# Altium project motordriver-v6.0.PrjPcb (part 1 of 2)
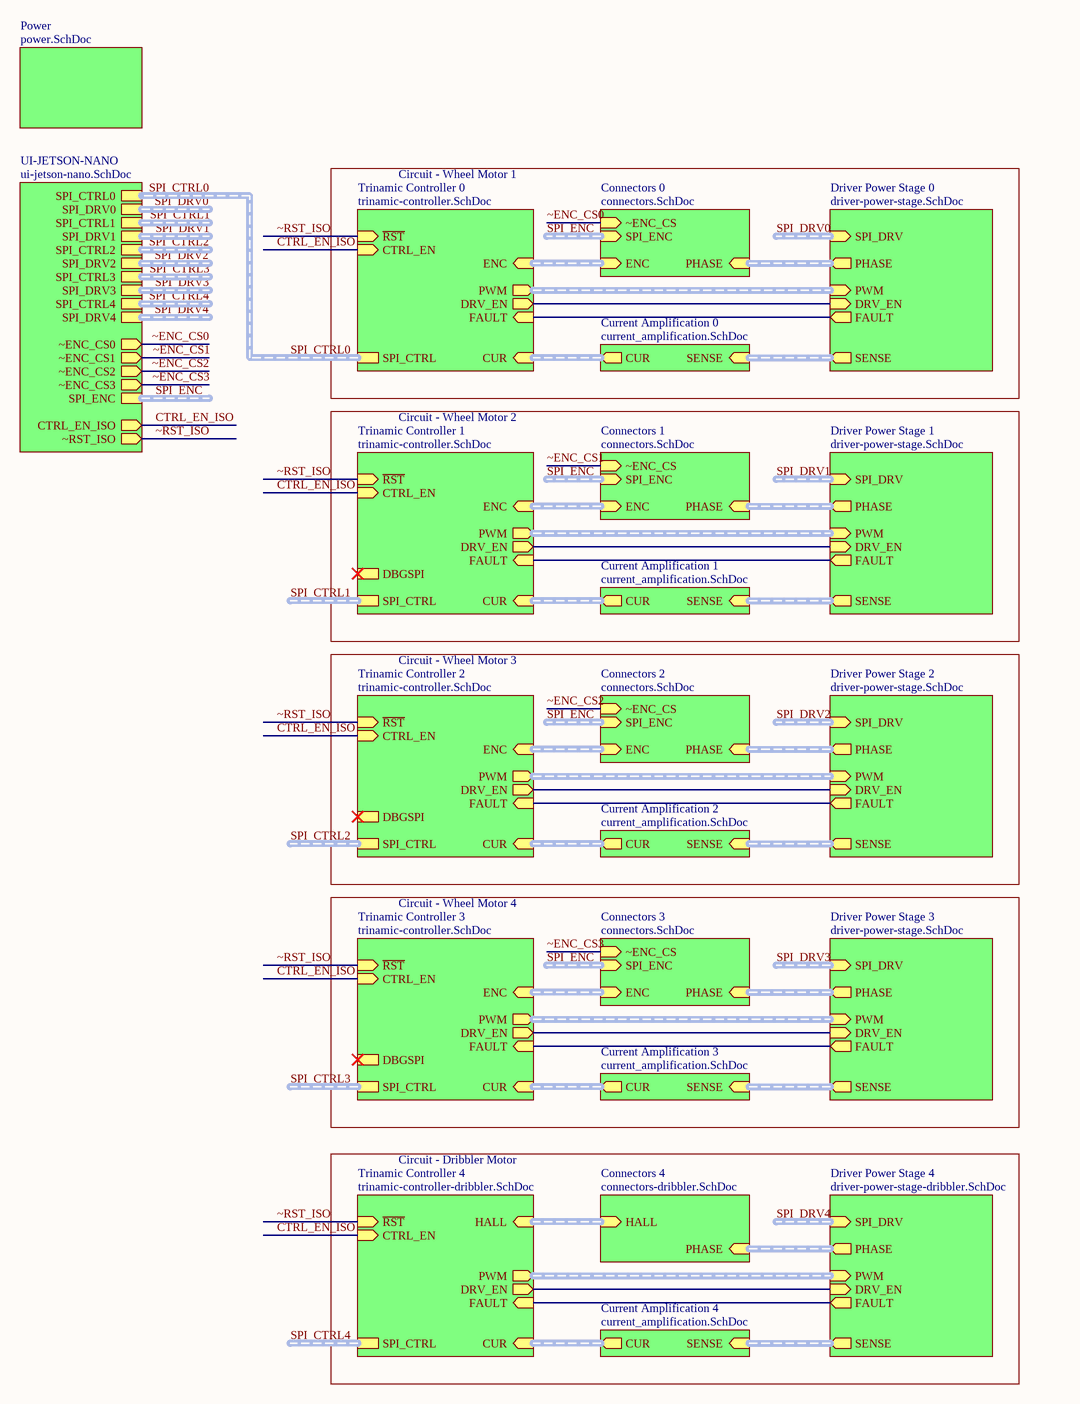
[diagram p0: root.SchDoc]
7 sheets, 321 parts. Net scope: hierarchical (ports join the sheet entries above them; power ports are global).
Board file: motordriver-v5.3.PcbDoc
Sheets:
  root.SchDoc
    Driver Power Stage 0 = driver-power-stage.SchDoc
    Connectors 0 = connectors.SchDoc
    Power = power.SchDoc
    UI-JETSON-NANO = ui-jetson-nano.SchDoc
      U_isolation_0 = isolation.SchDoc
      U_isolation_1 = isolation.SchDoc
      U_isolation_2 = isolation.SchDoc
      U_isolation_3 = isolation.SchDoc
    Trinamic Controller 4 = trinamic-controller-dribbler.SchDoc
    Driver Power Stage 1 = driver-power-stage.SchDoc
    Connectors 1 = connectors.SchDoc
    Driver Power Stage 2 = driver-power-stage.SchDoc
    Connectors 2 = connectors.SchDoc
    Driver Power Stage 3 = driver-power-stage.SchDoc
    Connectors 3 = connectors.SchDoc

## Sheet root.SchDoc
size 420 x 297 mm; SheetNumber: 2; SheetTotal: 14

### Sub-sheets
Connectors 0 = connectors.SchDoc: PHASE (in, harness PHASE), ENC (in, harness ENC), SPI_ENC (in, harness SPI_ENC), ~ENC_CS (in)
Connectors 1 = connectors.SchDoc: PHASE (in, harness PHASE), ENC (in, harness ENC), SPI_ENC (in, harness SPI_ENC), ~ENC_CS (in)
Connectors 2 = connectors.SchDoc: PHASE (in, harness PHASE), ENC (in, harness ENC), SPI_ENC (in, harness SPI_ENC), ~ENC_CS (in)
Connectors 3 = connectors.SchDoc: PHASE (in, harness PHASE), ENC (in, harness ENC), SPI_ENC (in, harness SPI_ENC), ~ENC_CS (in)
Connectors 4 = connectors-dribbler.SchDoc (file not in this document): PHASE (in, harness PHASE), HALL (in, harness ENC)
Current Amplification 0 = current_amplification.SchDoc (file not in this document): SENSE (in, harness SENSE), CUR (out, harness CUR)
Current Amplification 1 = current_amplification.SchDoc (file not in this document): SENSE (in, harness SENSE), CUR (out, harness CUR)
Current Amplification 2 = current_amplification.SchDoc (file not in this document): SENSE (in, harness SENSE), CUR (out, harness CUR)
Current Amplification 3 = current_amplification.SchDoc (file not in this document): SENSE (in, harness SENSE), CUR (out, harness CUR)
Current Amplification 4 = current_amplification.SchDoc (file not in this document): SENSE (in, harness SENSE), CUR (out, harness CUR)
Driver Power Stage 0 = driver-power-stage.SchDoc: DRV_EN (in), PWM (in, harness PWM), FAULT (out), SENSE (out, harness SENSE), PHASE (out, harness PHASE), SPI_DRV (in, harness DRV)
Driver Power Stage 1 = driver-power-stage.SchDoc: DRV_EN (in), PWM (in, harness PWM), FAULT (out), SENSE (out, harness SENSE), PHASE (out, harness PHASE), SPI_DRV (in, harness DRV)
Driver Power Stage 2 = driver-power-stage.SchDoc: DRV_EN (in), PWM (in, harness PWM), FAULT (out), SENSE (out, harness SENSE), PHASE (out, harness PHASE), SPI_DRV (in, harness DRV)
Driver Power Stage 3 = driver-power-stage.SchDoc: DRV_EN (in), PWM (in, harness PWM), FAULT (out), SENSE (out, harness SENSE), PHASE (out, harness PHASE), SPI_DRV (in, harness DRV)
Driver Power Stage 4 = driver-power-stage-dribbler.SchDoc (file not in this document): DRV_EN (in), PWM (in, harness PWM), FAULT (out), SENSE (out, harness SENSE), PHASE (out, harness PHASE), SPI_DRV (in, harness DRV)
Power = power.SchDoc: no entries
Trinamic Controller 0 = trinamic-controller.SchDoc (file not in this document): ~{RST} (in), CUR (in, harness CUR), DRV_EN (out), CTRL_EN (in), PWM (out, harness PWM), FAULT (in), ENC (in, harness ENC), SPI_CTRL (harness CTRL)
Trinamic Controller 1 = trinamic-controller.SchDoc (file not in this document): ~{RST} (in), CUR (in, harness CUR), DRV_EN (out), CTRL_EN (in), PWM (out, harness PWM), FAULT (in), ENC (in, harness ENC), SPI_CTRL (harness CTRL), DBGSPI (harness DRV)
Trinamic Controller 2 = trinamic-controller.SchDoc (file not in this document): ~{RST} (in), CUR (in, harness CUR), DRV_EN (out), CTRL_EN (in), PWM (out, harness PWM), FAULT (in), ENC (in, harness ENC), SPI_CTRL (harness CTRL), DBGSPI (harness DRV)
Trinamic Controller 3 = trinamic-controller.SchDoc (file not in this document): ~{RST} (in), CUR (in, harness CUR), DRV_EN (out), CTRL_EN (in), PWM (out, harness PWM), FAULT (in), ENC (in, harness ENC), SPI_CTRL (harness CTRL), DBGSPI (harness DRV)
Trinamic Controller 4 = trinamic-controller-dribbler.SchDoc: ~{RST} (in), CUR (in, harness CUR), DRV_EN (out), CTRL_EN (in), PWM (out, harness PWM), FAULT (in), SPI_CTRL (harness CTRL), HALL (in, harness ENC)
UI-JETSON-NANO = ui-jetson-nano.SchDoc: SPI_CTRL0 (harness CTRL), SPI_DRV0 (harness DRV), SPI_ENC (harness SPI_ENC), ~ENC_CS0 (out), ~ENC_CS1 (out), ~ENC_CS2 (out), ~ENC_CS3 (out), SPI_CTRL4 (harness CTRL), SPI_CTRL1 (harness CTRL), SPI_DRV1 (harness DRV), SPI_CTRL2 (harness CTRL), SPI_DRV2 (harness DRV), SPI_CTRL3 (harness CTRL), SPI_DRV3 (harness DRV), SPI_DRV4 (harness DRV), ~RST_ISO (out), CTRL_EN_ISO (out)

### Nets
CTRL_EN_ISO: sheet Trinamic Controller 0/CTRL_EN, sheet UI-JETSON-NANO/CTRL_EN_ISO, sheet Trinamic Controller 4/CTRL_EN, sheet Trinamic Controller 1/CTRL_EN, sheet Trinamic Controller 2/CTRL_EN, sheet Trinamic Controller 3/CTRL_EN
DRV_EN: sheet Driver Power Stage 4/DRV_EN, sheet Trinamic Controller 4/DRV_EN
DRV_EN_Driver Power Stage 0: sheet Driver Power Stage 0/DRV_EN, sheet Trinamic Controller 0/DRV_EN
DRV_EN_Driver Power Stage 1: sheet Driver Power Stage 1/DRV_EN, sheet Trinamic Controller 1/DRV_EN
DRV_EN_Driver Power Stage 2: sheet Driver Power Stage 2/DRV_EN, sheet Trinamic Controller 2/DRV_EN
DRV_EN_Driver Power Stage 3: sheet Driver Power Stage 3/DRV_EN, sheet Trinamic Controller 3/DRV_EN
FAULT: sheet Driver Power Stage 4/FAULT, sheet Trinamic Controller 4/FAULT
FAULT_Driver Power Stage 0: sheet Driver Power Stage 0/FAULT, sheet Trinamic Controller 0/FAULT
FAULT_Driver Power Stage 1: sheet Driver Power Stage 1/FAULT, sheet Trinamic Controller 1/FAULT
FAULT_Driver Power Stage 2: sheet Driver Power Stage 2/FAULT, sheet Trinamic Controller 2/FAULT
FAULT_Driver Power Stage 3: sheet Driver Power Stage 3/FAULT, sheet Trinamic Controller 3/FAULT
~ENC_CS0: sheet Connectors 0/~ENC_CS, sheet UI-JETSON-NANO/~ENC_CS0
~ENC_CS1: sheet UI-JETSON-NANO/~ENC_CS1, sheet Connectors 1/~ENC_CS
~ENC_CS2: sheet UI-JETSON-NANO/~ENC_CS2, sheet Connectors 2/~ENC_CS
~ENC_CS3: sheet UI-JETSON-NANO/~ENC_CS3, sheet Connectors 3/~ENC_CS
~RST_ISO: sheet Trinamic Controller 0/~{RST}, sheet UI-JETSON-NANO/~RST_ISO, sheet Trinamic Controller 4/~{RST}, sheet Trinamic Controller 1/~{RST}, sheet Trinamic Controller 2/~{RST}, sheet Trinamic Controller 3/~{RST}

### Buses and harness runs
harness sheet Connectors 0/ENC = sheet Trinamic Controller 0/ENC
harness sheet Connectors 0/PHASE = sheet Driver Power Stage 0/PHASE
harness sheet Connectors 1/ENC = sheet Trinamic Controller 1/ENC
harness sheet Connectors 1/PHASE = sheet Driver Power Stage 1/PHASE
harness sheet Connectors 2/ENC = sheet Trinamic Controller 2/ENC
harness sheet Connectors 2/PHASE = sheet Driver Power Stage 2/PHASE
harness sheet Connectors 3/ENC = sheet Trinamic Controller 3/ENC
harness sheet Connectors 3/PHASE = sheet Driver Power Stage 3/PHASE
harness sheet Connectors 4/HALL = sheet Trinamic Controller 4/HALL
harness sheet Connectors 4/PHASE = sheet Driver Power Stage 4/PHASE
harness sheet Current Amplification 0/CUR = sheet Trinamic Controller 0/CUR
harness sheet Current Amplification 0/SENSE = sheet Driver Power Stage 0/SENSE
harness sheet Current Amplification 1/CUR = sheet Trinamic Controller 1/CUR
harness sheet Current Amplification 1/SENSE = sheet Driver Power Stage 1/SENSE
harness sheet Current Amplification 2/CUR = sheet Trinamic Controller 2/CUR
harness sheet Current Amplification 2/SENSE = sheet Driver Power Stage 2/SENSE
harness sheet Current Amplification 3/CUR = sheet Trinamic Controller 3/CUR
harness sheet Current Amplification 3/SENSE = sheet Driver Power Stage 3/SENSE
harness sheet Current Amplification 4/CUR = sheet Trinamic Controller 4/CUR
harness sheet Current Amplification 4/SENSE = sheet Driver Power Stage 4/SENSE
harness sheet Driver Power Stage 0/PWM = sheet Trinamic Controller 0/PWM
harness sheet Driver Power Stage 1/PWM = sheet Trinamic Controller 1/PWM
harness sheet Driver Power Stage 2/PWM = sheet Trinamic Controller 2/PWM
harness sheet Driver Power Stage 3/PWM = sheet Trinamic Controller 3/PWM
harness sheet Driver Power Stage 4/PWM = sheet Trinamic Controller 4/PWM
harness SPI_CTRL0 = sheet Trinamic Controller 0/SPI_CTRL = sheet UI-JETSON-NANO/SPI_CTRL0
harness SPI_CTRL1 = sheet Trinamic Controller 1/SPI_CTRL
harness SPI_CTRL1 = sheet UI-JETSON-NANO/SPI_CTRL1
harness SPI_CTRL2 = sheet Trinamic Controller 2/SPI_CTRL
harness SPI_CTRL2 = sheet UI-JETSON-NANO/SPI_CTRL2
harness SPI_CTRL3 = sheet Trinamic Controller 3/SPI_CTRL
harness SPI_CTRL3 = sheet UI-JETSON-NANO/SPI_CTRL3
harness SPI_CTRL4 = sheet Trinamic Controller 4/SPI_CTRL
harness SPI_CTRL4 = sheet UI-JETSON-NANO/SPI_CTRL4
harness SPI_DRV0 = sheet Driver Power Stage 0/SPI_DRV
harness SPI_DRV0 = sheet UI-JETSON-NANO/SPI_DRV0
harness SPI_DRV1 = sheet Driver Power Stage 1/SPI_DRV
harness SPI_DRV1 = sheet UI-JETSON-NANO/SPI_DRV1
harness SPI_DRV2 = sheet Driver Power Stage 2/SPI_DRV
harness SPI_DRV2 = sheet UI-JETSON-NANO/SPI_DRV2
harness SPI_DRV3 = sheet Driver Power Stage 3/SPI_DRV
harness SPI_DRV3 = sheet UI-JETSON-NANO/SPI_DRV3
harness SPI_DRV4 = sheet Driver Power Stage 4/SPI_DRV
harness SPI_DRV4 = sheet UI-JETSON-NANO/SPI_DRV4
harness SPI_ENC = sheet Connectors 0/SPI_ENC
harness SPI_ENC = sheet Connectors 1/SPI_ENC
harness SPI_ENC = sheet Connectors 2/SPI_ENC
harness SPI_ENC = sheet Connectors 3/SPI_ENC
harness SPI_ENC = sheet UI-JETSON-NANO/SPI_ENC

### Notes on the sheet
- Circuit - Wheel Motor 1
- Circuit - Wheel Motor 2
- Circuit - Wheel Motor 3
- Circuit - Wheel Motor 4
- Circuit - Dribbler Motor
- TITLE
- SCALE:
- A3
- SIZE
- FILE NAME
- SHEET
- OF
- REV

## Sheet driver-power-stage.SchDoc
size A4; SheetNumber: 10; SheetTotal: 14
Used 4 times, as channels Driver Power Stage 0, Driver Power Stage 1, Driver Power Stage 2, Driver Power Stage 3. Parts and nets are listed once, with the designators drawn on the sheet.
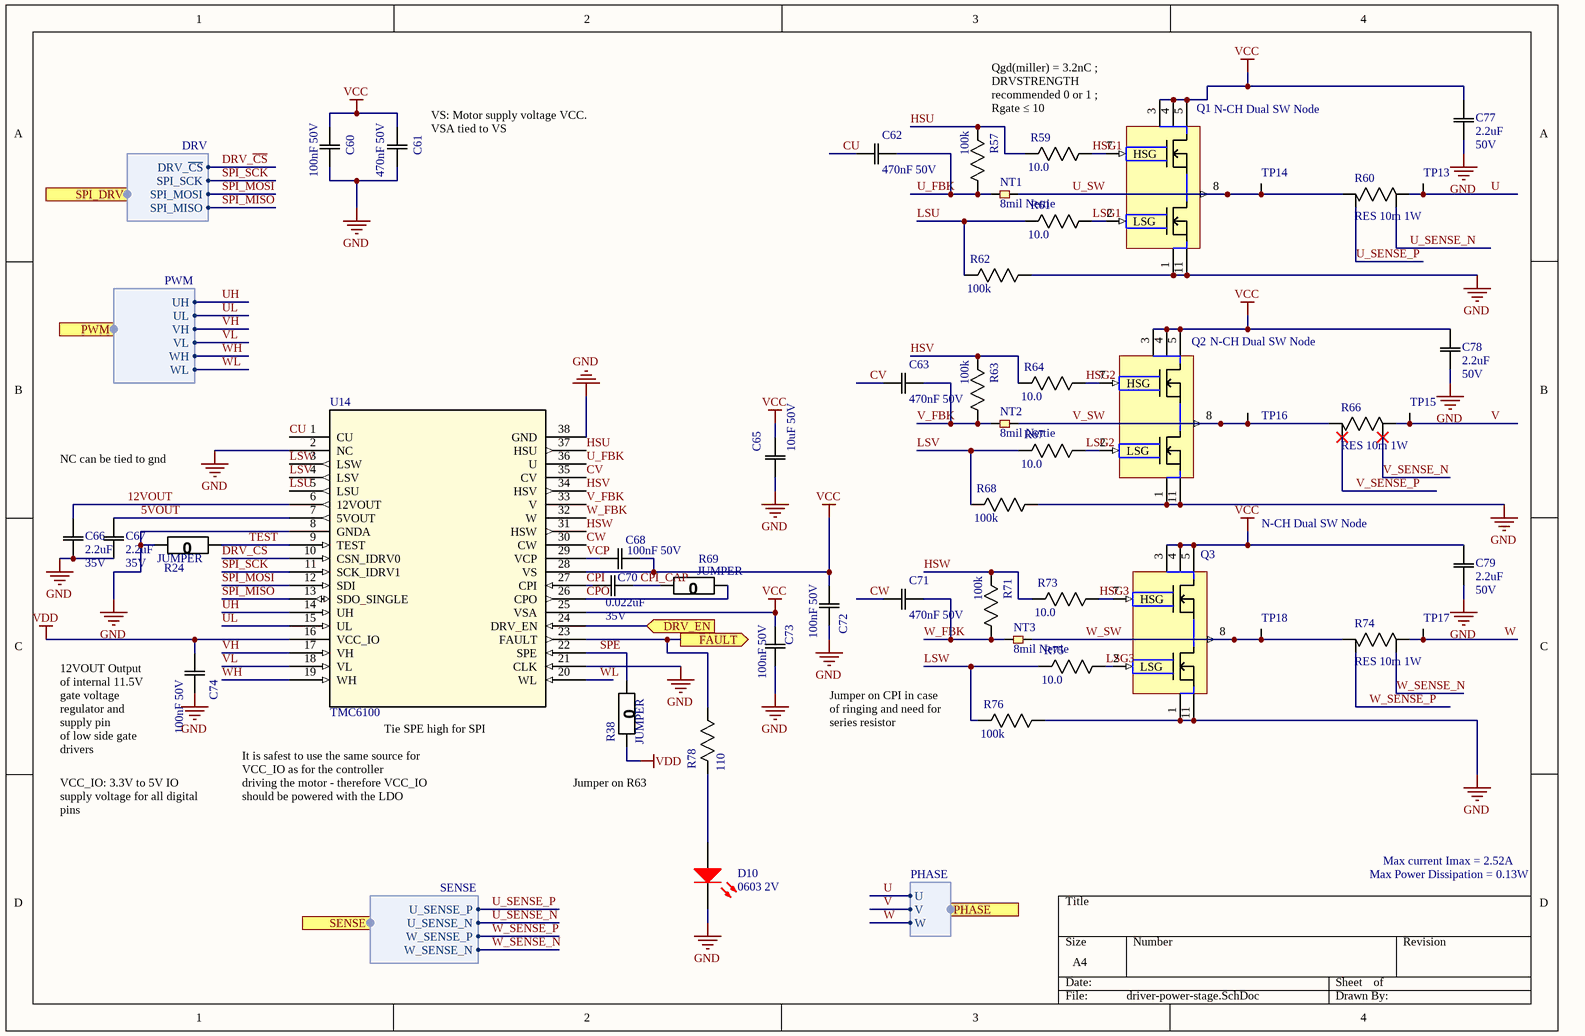
[diagram p1: driver-power-stage.SchDoc]

### Parts
C60  100nF 50V  [0603]
C61  470nF 50V  [0603]
C62  470nF 50V  [0603]
C63  470nF 50V  [0603]
C65  10uF 50V  [0805]
C66  value 2.2uF  Rating: 35V  [0603]  (hidden comment: 2.2uF 35V)
C67  value 2.2uF  Rating: 35V  [0603]  (hidden comment: 2.2uF 35V)
C68  100nF 50V  [0603]
C70  value 0.022uF  Rating: 35V  [0603]  (hidden comment: 0.022uF 35V)
C71  470nF 50V  [0603]
C72  100nF 50V  [0603]
C73  100nF 50V  [0603]
C74  100nF 50V  [0603]
C77  Rating: 50V  [0603]  (hidden comment: 2.2uF)
C78  Rating: 50V  [0603]  (hidden comment: 2.2uF)
C79  Rating: 50V  [0603]  (hidden comment: 2.2uF)
D10  0603 2V  [0603 - LED2]
NT1  8mil Nettie  [NT_8mil]  (net tie, no BOM)
NT2  8mil Nettie  [NT_8mil]  (net tie, no BOM)
NT3  8mil Nettie  [NT_8mil]  (net tie, no BOM)
Q1  N-CH Dual SW Node  [12-PowerWQFN]
Q2  N-CH Dual SW Node  [12-PowerWQFN]
Q3  N-CH Dual SW Node  [12-PowerWQFN]
R24  JUMPER  [0603]
R38  JUMPER  [0603]
R57  100k  [0603]
R59  10.0  [0603]
R60  RES 10m 1W  [1206 - Current Sense]
R61  10.0  [0603]
R62  100k  [0603]
R63  100k  [0603]
R64  10.0  [0603]
R66  RES 10m 1W  [1206 - Current Sense]
R67  10.0  [0603]
R68  100k  [0603]
R69  JUMPER  [0603]
R71  100k  [0603]
R73  10.0  [0603]
R74  RES 10m 1W  [1206 - Current Sense]
R75  10.0  [0603]
R76  100k  [0603]
R78  110  [0603]
TP13  U_SL  [TP]  (value not drawn)  (no BOM)
TP14  U_SH  [TP]  (value not drawn)  (no BOM)
TP15  V_SL  [TP]  (value not drawn)  (no BOM)
TP16  V_SH  [TP]  (value not drawn)  (no BOM)
TP17  W_SL  [TP]  (value not drawn)  (no BOM)
TP18  W_SH  [TP]  (value not drawn)  (no BOM)
U14  TMC6100  [QFN50P700X700X85_HS-38N]

### Ports
DRV_EN (in), FAULT (out), PHASE (harness PHASE), PWM (harness PWM), SENSE (harness SENSE), SPI_DRV (harness DRV)

### Harnesses
PWM: VL, WH, WL, VH, UL, UH
SENSE: U_SENSE_P, U_SENSE_N, W_SENSE_P, W_SENSE_N
PHASE: U, V, W
DRV: SPI_SCK, SPI_MISO, SPI_MOSI, DRV_~{CS}

### Nets
GND: C60.2(C2) C61.2(C2) C65.1(C1) C66.1(C1) C67.1(C1) C72.2(C2) C73.2(C2) C74.2(C2) C77.1(C1) C78.1(C1) C79.1(C1) D10.2(K) Q1.1(GND) Q1.11(GND) Q2.1(GND) Q2.11(GND) Q3.1(GND) Q3.11(GND) R24.2(R2) R62.1(R1) R68.1(R1) R76.1(R1) U14.2(NC) U14.8(GNDA) U14.21(CLK) U14.38(GND)
VCC: C60.1(C1) C61.1(C1) C65.2(C2) C68.2(C2) C72.1(C1) C73.1(C1) C77.2(C2) C78.2(C2) C79.2(C2) Q1.3(V+) Q1.4(V+) Q1.5(V+) Q2.3(V+) Q2.4(V+) Q2.5(V+) Q3.3(V+) Q3.4(V+) Q3.5(V+) U14.25(VSA) U14.28(VS)
VDD: C74.1(C1) R38.2(R2) U14.16(VCC_IO)
5VOUT: C67.2(C2) U14.7(5VOUT)
12VOUT: C66.2(C2) U14.6(12VOUT)
CPI: C70.1(C1) U14.27(CPI)
CPI_CAP: C70.2(C2) R69.2(R2)
CPO: R69.1(R1) U14.26(CPO)
CU: C62.1(C1) U14.1(CU)
CV: C63.1(C1) U14.35(CV)
CW: C71.1(C1) U14.30(CW)
DRV_~{CS}: U14.10(CSN_IDRV0) ; port SPI_DRV.DRV_~{CS}
DRV_EN: U14.24(DRV_EN) ; port DRV_EN
FAULT: R78.1(R1) U14.23(FAULT) ; port FAULT
HSG1: Q1.7(HSG) R59.1(R1)
HSG2: Q2.7(HSG) R64.1(R1)
HSG3: Q3.7(HSG) R73.1(R1)
HSU: R57.2(R2) R59.2(R2) U14.37(HSU)
HSV: R63.2(R2) R64.2(R2) U14.34(HSV)
HSW: R71.2(R2) R73.2(R2) U14.31(HSW)
LSG1: Q1.2(LSG) R61.1(R1)
LSG2: Q2.2(LSG) R67.1(R1)
LSG3: Q3.2(LSG) R75.1(R1)
LSU: R61.2(R2) R62.2(R2) U14.5(LSU)
LSV: R67.2(R2) R68.2(R2) U14.4(LSV)
LSW: R75.2(R2) R76.2(R2) U14.3(LSW)
SPE: R38.1(R1) U14.22(SPE)
SPI_MISO: U14.13(SDO_SINGLE) ; port SPI_DRV.SPI_MISO
SPI_MOSI: U14.12(SDI) ; port SPI_DRV.SPI_MOSI
SPI_SCK: U14.11(SCK_IDRV1) ; port SPI_DRV.SPI_SCK
TEST: R24.1(R1) U14.9(TEST)
U: R60.1 TP13.1 ; port PHASE.U
U_FBK: C62.2(C2) NT1.1 R57.1(R1) U14.36(U)
U_SENSE_N: R60.S1 ; port SENSE.U_SENSE_N
U_SENSE_P: R60.S2 ; port SENSE.U_SENSE_P
U_SW: NT1.2 Q1.8(SW) R60.2 TP14.1
UH: U14.14(UH) ; port PWM.UH
UL: U14.15(UL) ; port PWM.UL
V: R66.1 TP15.1 ; port PHASE.V
V_FBK: C63.2(C2) NT2.1 R63.1(R1) U14.33(V)
V_SENSE_N: R66.S1
V_SENSE_P: R66.S2
V_SW: NT2.2 Q2.8(SW) R66.2 TP16.1
VCP: C68.1(C1) U14.29(VCP)
VH: U14.17(VH) ; port PWM.VH
VL: U14.18(VL) ; port PWM.VL
W: R74.1 TP17.1 ; port PHASE.W
W_FBK: C71.2(C2) NT3.1 R71.1(R1) U14.32(W)
W_SENSE_N: R74.S1 ; port SENSE.W_SENSE_N
W_SENSE_P: R74.S2 ; port SENSE.W_SENSE_P
W_SW: NT3.2 Q3.8(SW) R74.2 TP18.1
WH: U14.19(WH) ; port PWM.WH
WL: U14.20(WL) ; port PWM.WL
NetD10_1: D10.1(A) R78.2(R2)

### Channels
Driver Power Stage 0: designators end in A; ports DRV_EN=DRV_EN_Driver Power Stage 0 FAULT=FAULT_Driver Power Stage 0
Driver Power Stage 1: designators end in B; ports DRV_EN=DRV_EN_Driver Power Stage 1 FAULT=FAULT_Driver Power Stage 1
Driver Power Stage 2: designators end in C; ports DRV_EN=DRV_EN_Driver Power Stage 2 FAULT=FAULT_Driver Power Stage 2
Driver Power Stage 3: designators end in D; ports DRV_EN=DRV_EN_Driver Power Stage 3 FAULT=FAULT_Driver Power Stage 3

### Notes on the sheet
- Text
- (near Q1) Qgd(miller) = 3.2nC ; DRVSTRENGTH recommended 0 or 1 ; Rgate ≤ 10
- (near C61) VS: Motor supply voltage VCC. VSA tied to VS
- NC can be tied to gnd
- (near C74) 12VOUT Output of internal 11.5V gate voltage regulator and supply pin
  of low side gate drivers
- Tie SPE high for SPI
- Jumper on CPI in case of ringing and need for series resistor
- VCC_IO: 3.3V to 5V IO supply voltage for all digital pins
- It is safest to use the same source for VCC_IO as for the controller
  driving the motor - therefore VCC_IO should be powered with the LDO
- Jumper on R63
- Max Power Dissipation = 0.13W
- Max current Imax = 2.52A

### Library data of the parts
C60 C68 C72-C74 = CAP 100nF 50V: Default Symbol for Capacitors; Manufacturer Part Number 1: CC0603KPX7R9BB104; Tolerance: 10%; Temperature Coefficient: X7R; VALUE: 100nF; Rating: 50V; Part Number: CAP 100nF 50V; Supplier 1: Digi-Key; Supplier Part Number 1: 311-3567-1-ND; Manufacturer Part Number 2: 0805J0500104KJT; Supplier 2: Digi-Key; Supplier Part Number 2: 1608-1458-1-ND
C61-C63 C71 = CAP 470nF 50V: Default Symbol for Capacitors; Manufacturer Part Number 1: C1608X7R1H474K080AC; Tolerance: 10%; Temperature Coefficient: X7R; VALUE: 470nF; Rating: 50V; Part Number: CAP 470nF 50V; Supplier 1: Digi-Key; Supplier Part Number 1: 445-5952-1-ND; Manufacturer Part Number 2: CL21B474KBFNNNG; Supplier 2: Digi-Key; Supplier Part Number 2: 1276-6482-1-ND
C65 = CAP 10uF 50V: Default Symbol for Capacitors; Manufacturer Part Number 1: GRM21BR61H106KE43L; Tolerance: 10%; Temperature Coefficient: X5R; VALUE: 10uF; Rating: 50V; Part Number: CAP 10uF 50V; Supplier 1: Digi-Key; Supplier Part Number 1: 490-18663-1-ND; Manufacturer Part Number 2: CL32B106KBJNNWE; Supplier 2: Digi-Key; Supplier Part Number 2: 1276-3388-1-ND
C66 C67 = CAP 2.2uF 35V: Default Symbol for Capacitors; Manufacturer Part Number 1: C1608X5R1V225K080AC; Tolerance: 10%; Temperature Coefficient: X5R; Part Number: CAP 2.2uF 35V; Supplier 1: Digi-Key; Supplier Part Number 1: 445-8025-1-ND; Manufacturer Part Number 2: CGA4J1X7R1V225K125AE; Supplier 2: Digi-Key; Supplier Part Number 2: 445-8787-1-ND
C70 = CAP 0.022uF 35V: Default Symbol for Capacitors; Manufacturer Part Number 1: GMK107BJ223KAHT; Tolerance: 10%; Temperature Coefficient: X7R; Part Number: CAP 0.022uF 35V; Supplier 1: Digi-Key; Supplier Part Number 1: 587-3359-1-ND; Manufacturer Part Number 2: GMK212SD223KG-T; Supplier 2: Digi-Key; Supplier Part Number 2: 587-1122-1-ND
C77-C79 = CAP 2.2uF 50V: CAP CER 2.2UF 50V X5R 0603/0805; Manufacturer Part Number 1: GRM188R61H225KE11D; Tolerance: 10%; Package: 0603/0805; Temperature Coefficient: X5R; Operating Temperature: -55°C ~ 125°C; Value: 2.2uF; Part Number: CAP 2.2uF 50V; Supplier 1: Mouser; Supplier Part Number 1: 81-GRM188R61H225KE1D
D10 = LED RED SMD 0603: 0603 red led alingap 631nm-639nm water clear 18-180mcd 130d; Manufacturer Part Number 1: LTST-C190KRKT; Current Rating: 20mA; Supplier 1: Digi-Key; Supplier Part Number 1: 160-1436-1-ND; Part Number: LED RED SMD 0603; Supplier URL 1: https://www.digikey.ca/en/products/detail/lite-on-inc/LTST-C190KRKT/386817?s=N4IgTCBcDaIIwDYAMBaOAWAzAtKByAIiALoC%2BQA; Pin Count: 2; Voltage Rating - DC: 2V
NT1-NT3 = NT_8: 8mil wide nettie; Value: 0; Part Number: NT_8
Q1-Q3 = MOSFET N-CH DUAL NTTFD4D0N04HLTWG: MOSFET N+N COMMON PHASE SW 40V 60A; Supplier 1: Digi-Key; Supplier Part Number 1: 488-NTTFD4D0N04HLTWGCT-ND; Part Number: MOSFET N-CH DUAL NTTFD4D0N04HLTWG; Supplier URL 1: https://www.digikey.ca/en/products/detail/onsemi/NTTFD4D0N04HLTWG/12181286?s=N4IgTCBcDaIHIBUEDEAiAWVAGOX0AkAZBAdQHEBhBEAXQF8g; Manufacturer Part Number 1: NTTFD4D0N04HLTWG
R24 R38 R69 = RES 0 JUMPER: RES SMD 0 OHM JUMPER GENERIC 0805; Manufacturer Part Number 1: RK73Z1JTTD; VALUE: 0; Package: 0805; Part Number: RES 0 JUMPER; Supplier 1: Digi-Key; Supplier Part Number 1: 2019-RK73Z1JTTDCT-ND; Supplier URL 1: https://www.digikey.ca/en/products/detail/koa-speer-electronics-inc/RK73Z1JTTD/9845478; Tolerance: N/A
R57 R62 R63 R68 R71 R76 = RES 100k 1/8W 5%: RES SMD 100K OHM 5% 1/8W 0805; Power (Watts): 0.125W; Package: 0805; VALUE: 100k; Tolerance: 5%; Part Number: RES 100k 1/8W 5%
R59 R61 R64 R67 R73 R75 = RES 10.0 1/8W - 1%: Default Resistor Symbol; Manufacturer Part Number 1: RNCP0603FTD10R0; VALUE: 10; Power (Watts): 0.125W; Tolerance: 1%; Package: 0805; Part Number: RES 10.0 1/8W - 1%; Supplier 1: Digi-Key; Supplier Part Number 1: RNCP0603FTD10R0CT-ND; Manufacturer Part Number 2: RNCP0603FTD10R0; Supplier 2: Digi-Key; Supplier Part Number 2: RNCP0603FTD10R0CT-ND; Tolerance 2: 1%; Supplier URL 1: https://www.digikey.ca/en/products/detail/stackpole-electronics-inc/RNCP0603FTD10R0/2240074?s=N4IgTCBcDaIEoDkDCAFADANjQZgGIBUARARjTjSXxAF0BfIA; Supplier URL 2: https://www.digikey.ca/en/products/detail/stackpole-electronics-inc/RNCP0603FTD10R0/2240074?s=N4IgTCBcDaIEoDkDCAFADANjQZgGIBUARARjTjSXxAF0BfIA
R60 R66 R74 = RES 10m 1W: RES SMD 0.01 OHM 1% 1W 1206; Manufacturer Part Number 1: CSRL1-0R01F8; Part Number: RES 10m 1W; Value: 10m; Tolerance: 1%; Supplier 1: Digi-Key; Supplier Part Number 1: 696-1845-1-ND; Supplier URL 1: https://www.digikey.ca/en/products/detail/riedon/CSRL1-0R01F8/9666060?s=N4IgTCBcDaIGwE44FoCMAOALAVjcgcgCIgC6AvkA
R78 = RES 110.0 1/8W - 1%: Default Resistor Symbol; Manufacturer Part Number 1: RMCF0603FT110R; Power (Watts): 0.125W; Tolerance: 1%; Package: 0805; Value: 110; Part Number: RES 110.0 1/8W - 1%; Supplier 1: Digi-Key; Supplier Part Number 1: RMCF0603FT110RCT-ND; Supplier URL 1: https://www.digikey.ca/en/products/detail/stackpole-electronics-inc/RMCF0603FT110R/1761268
TP13-TP18 = Test Point (Via): Part Number: Test Point (Via)
U14 = TMC6100: GATE DRIVER IC 8-60V QFN37; Manufacturer Part Number 1: TMC6100-LA; Supplier 1: Newark; Supplier Part Number 1: 54AH1603; Part Number: TMC6100; Supplier URL 1: https://canada.newark.com/trinamic/tmc6100-la/motor-driver-40-to-125deg-c-rohs/dp/54AH1603?ost=54ah1603

## Sheet connectors.SchDoc
size A4; SheetNumber: 13; SheetTotal: 14
Used 4 times, as channels Connectors 0, Connectors 1, Connectors 2, Connectors 3. Parts and nets are listed once, with the designators drawn on the sheet.
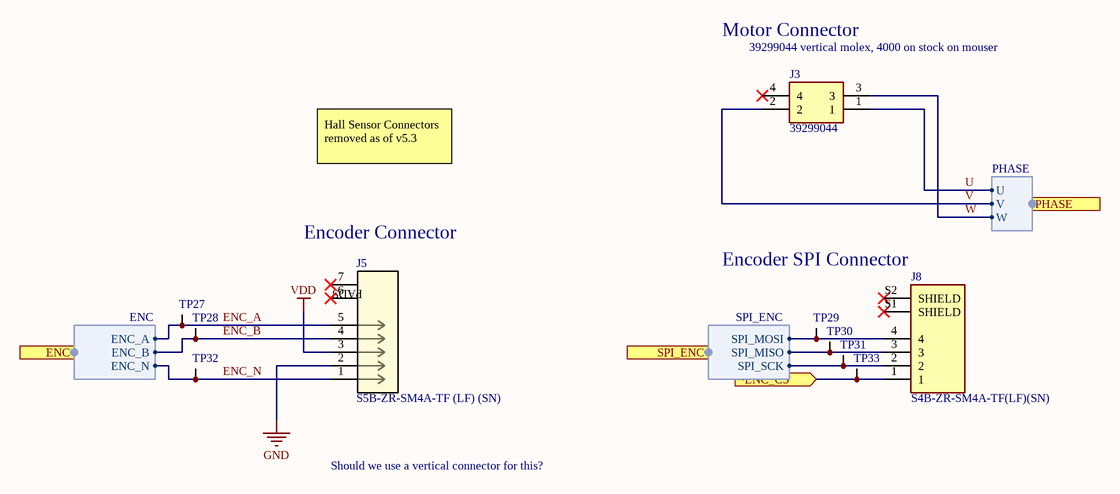
[diagram p2: connectors.SchDoc]

### Parts
J3  39299044  [39299044]
J5  S5B-ZR-SM4A-TF (LF) (SN)  [JST_S5B-ZR-SM4A-TF]
J8  S4B-ZR-SM4A-TF(LF)(SN)  [JST_S4B-ZR-SM4A-TF(LF)(SN)]  (no BOM)
TP27  ENC_A  [TP]  (value not drawn)  (no BOM)
TP28  ENC_B  [TP]  (value not drawn)  (no BOM)
TP29  MOSI  [TP]  (value not drawn)  (no BOM)
TP30  MISO  [TP]  (value not drawn)  (no BOM)
TP31  SCK  [TP]  (value not drawn)  (no BOM)
TP32  ENC_N  [TP]  (value not drawn)  (no BOM)
TP33  ENC_CS  [TP]  (value not drawn)  (no BOM)

### Ports
ENC (harness ENC), PHASE (harness PHASE), SPI_ENC (harness SPI_ENC), ~ENC_CS (in)

### Harnesses
ENC: ENC_A, ENC_N, ENC_B
PHASE: U, V, W
SPI_ENC: SPI_SCK, SPI_MISO, SPI_MOSI

### Nets
GND: J5.2
VDD: J5.3
ENC_A: J5.5 TP27.1 ; port ENC.ENC_A
ENC_B: J5.4 TP28.1 ; port ENC.ENC_B
ENC_N: J5.1 TP32.1 ; port ENC.ENC_N
U: J3.1 ; port PHASE.U
V: J3.2 ; port PHASE.V
W: J3.3 ; port PHASE.W
~ENC_CS: J8.1 TP33.1 ; port ~ENC_CS
NetJ8_2: J8.2 TP31.1 ; port SPI_ENC.SPI_SCK
NetJ8_3: J8.3 TP30.1 ; port SPI_ENC.SPI_MISO
NetJ8_4: J8.4 TP29.1 ; port SPI_ENC.SPI_MOSI

Not connected (* = marked no-connect by the designer): J3 4*; J5 6* 7*; J8 S1(SHIELD)* S2(SHIELD)*

### Channels
Connectors 0: designators end in A; ports ~ENC_CS=~ENC_CS0
Connectors 1: designators end in B; ports ~ENC_CS=~ENC_CS1
Connectors 2: designators end in C; ports ~ENC_CS=~ENC_CS2
Connectors 3: designators end in D; ports ~ENC_CS=~ENC_CS3

### Notes on the sheet
- Motor Connector
- (near J3) 39299044 vertical molex, 4000 on stock on mouser
- Hall Sensor Connectors removed as of v5.3
- (near J5) Encoder Connector
- (near J8) Encoder SPI Connector
- Should we use a vertical connector for this?
- (in symbol CN 5POS JST ZR RA) PADS

### Library data of the parts
J3 = CN HDR 4POS Molex 39299044 VERT: Molex 39299044 4POS Minifit / dual row, vertical; Supplier 1: Digi-Key; Supplier Part Number 1: WM7336-ND; Part Number: CN HDR 4POS Molex 39299044 VERT; Supplier URL 1: https://www.digikey.ca/en/products/detail/molex/0039299044/1624292?s=N4IgTCBcDaIOoFkDsBmFA2AtAOQCIgF0BfIA; Pin Count: 4; Manufacturer Part Number 1: 39299044
J5 = CN 5POS JST ZR RA: Connector Header Surface Mount, Right Angle 5 position 0.059" (1.50mm); Supplier 1: Digi-Key; Supplier Part Number 1: 455-1696-1-ND; Part Number: CN 5POS JST ZR RA; Supplier URL 1: https://www.digikey.ca/en/products/detail/jst-sales-america-inc/S5B-ZR-SM4A-TF-LF-SN/926603?s=N4IgTCBcDaICwFYEFoCMA2AnOtyByAIiALoC%2BQA; Pin Count: 5; Manufacturer Part Number 1: S5B-ZR-SM4A-TF
J8 = CN 4POS JST ZR RA: Connector Header Surface Mount, Right Angle 4 position 0.059 (1.50mm); MF: JST Sales; SnapEDA_Link: https://www.snapeda.com/parts/S4B-ZR-SM4A-TF(LF)(SN)/JST%20Sales%20America%20Inc./view-part/449060/?ref=snap; Availability: Unavailable; Value: *; Price: None; Arrow_Electronics-Purchase-URL: https://snapeda.com/shop?store=Arrow+Electronics&id=449060; MP: S4B-ZR-SM4A-TF(LF)(SN); Package: None; Part Number: CN 4POS JST ZR RA; Supplier 1: Digi-Key; Supplier Part Number 1: 455-1695-1-ND; Supplier URL 1: https://www.digikey.ca/en/products/detail/jst-sales-america-inc/S4B-ZR-SM4A-TF-LF-SN/926602?s=N4IgTCBcDaIMoBYBCBaAWgJRXAsgggigCoBiAFADIkCUZcActSALoC%2BQA; Pin Count: 4
TP27-TP33 = Test Point (Via): Part Number: Test Point (Via)

## Sheet power.SchDoc
size A4; SheetNumber: 2; SheetTotal: 14
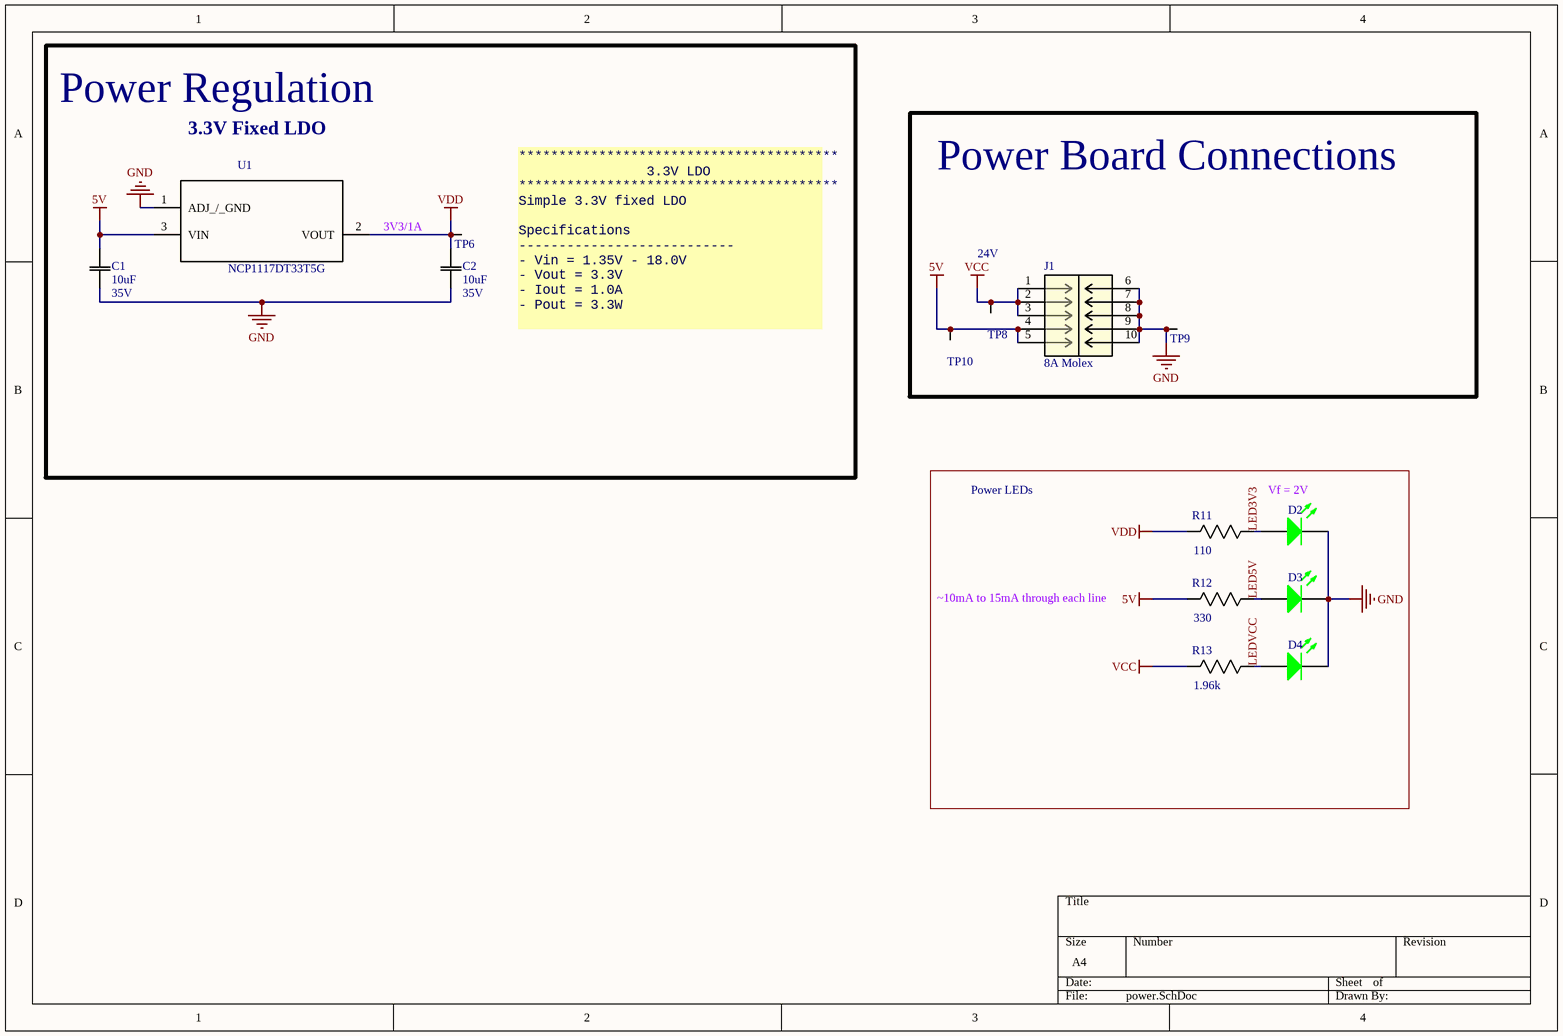
[diagram p3: power.SchDoc]

### Parts
C1  value 10uF  Rating: 35V  [0805]  (hidden comment: 10uF 35V)
C2  value 10uF  Rating: 35V  [0805]  (hidden comment: 10uF 35V)
D2  0603 2V  [0603 - LED]  (value not drawn)
D3  0603 2V  [0603 - LED]  (value not drawn)
D4  0603 2V  [0603 - LED]  (value not drawn)
J1  8A Molex  [MOLEX_0430451012]
R11  110  [0603]
R12  330  [0603]
R13  1.96k  [0603]
TP6  VDD  [TP]  (value not drawn)  (no BOM)
TP8  VCC  [TP]  (value not drawn)  (no BOM)
TP9  GND  [TP]  (value not drawn)  (no BOM)
TP10  5V  [TP]  (value not drawn)  (no BOM)
U1  NCP1117DT33T5G  [DPAK (TO-252)]

### Blocks framed on the sheet
Power Regulation: C1 C2 TP6 U1
Power Board Connections: J1 TP8-TP10

### Nets
5V: C1.2(C2) J1.4 J1.5 R12.2(R2) TP10.1 U1.3(VIN)
GND: C1.1(C1) C2.1(C1) D2.2(K) D3.2(K) D4.2(K) J1.6 J1.7 J1.8 J1.9 J1.10 TP9.1 U1.1(ADJ_/_GND)
VCC: J1.1 J1.2 J1.3 R13.2(R2) TP8.1
VDD: C2.2(C2) R11.2(R2) TP6.1 U1.2(VOUT)
LED3V3: D2.1(A) R11.1(R1)
LED5V: D3.1(A) R12.1(R1)
LEDVCC: D4.1(A) R13.1(R1)

### Notes on the sheet
- 3.3V Fixed LDO
- 3V3/1A
- 24V
- ****************************************
  3.3V LDO
  ****************************************
  Simple 3.3V fixed LDO
  Specifications
  ---------------------------
  - Vin = 1.35V - 18.0V
  - Vout = 3.3V
  - Iout = 1.0A
  - Pout = 3.3W
- Power LEDs
- Vf = 2V
- ~10mA to 15mA through each line

### Library data of the parts
C1 C2 = CAP 10uF 35V_1: Default Symbol for Capacitors; Manufacturer Part Number 1: C2012X5R1V106K125AC; Tolerance: 10%; Temperature Coefficient: X5R; Part Number: CAP 10uF 35V_1; Supplier 1: Digi-Key; Supplier Part Number 1: 445-14418-1-ND
D2-D4 = LED GREEN SMD 0603: LED Uni-Color Green 574nm 2-Pin Chip LED T/R; Manufacturer Part Number 1: LTST-C190KGKT; Current Rating: 20mA; Part Number: LED GREEN SMD 0603; Supplier 1: Digi-Key; Supplier Part Number 1: 160-1435-1-ND; Supplier URL 1: https://www.digikey.ca/en/products/detail/lite-on-inc/LTST-C190KGKT/386815?s=N4IgTCBcDaIIwDYAMBaOAWAzAVjSgcgCIgC6AvkA; Pin Count: 2; Voltage Rating - DC: 2V
J1 = CN HDR 10POS MOLEX 0430451012: CONN HEADER VERT 10POS 3MM; Supplier 1: Digi-Key; Supplier Part Number 1: WM1793-ND; Part Number: CN HDR 10POS MOLEX 0430451012; Supplier URL 1: https://www.digikey.ca/en/products/detail/molex/0430451012/252506?s=N4IgTCBcDaIAwBYDMiCsBGO6IF0C%2BQA; Pin Count: 10; Manufacturer Part Number 1: 0430451012
R11 = RES 110.0 1/8W - 1%: as R78 on sheet driver-power-stage; Package: 0805; Value: 110; Part Number: RES 110.0 1/8W - 1%; Supplier 1: Digi-Key; Supplier Part Number 1: RMCF0603FT110RCT-ND; Supplier URL 1: https://www.digikey.ca/en/products/detail/stackpole-electronics-inc/RMCF0603FT110R/1761268
R12 = RES 330.0 1/8W - 5%: Default Resistor Symbol; Manufacturer Part Number 1: RMCF0603JT330R; Power (Watts): 0.125W; Tolerance: 5%; Package: 0805; Value: 330; Part Number: RES 330.0 1/8W - 5%; Supplier 1: Digi-Key; Supplier Part Number 1: RMCF0603JT330RCT-ND; Supplier URL 1: https://www.digikey.ca/en/products/detail/stackpole-electronics-inc/RMCF0603JT330R/1757998
R13 = RES 1.96k 1/8W: Default Resistor Symbol; Manufacturer Part Number 1: RC0603FR-071K96L; Power (Watts): 0.125W; Tolerance: 1%; Package: 0805; Value: 1.96k; Part Number: RES 1.96k 1/8W; Supplier 1: Digi-Key; Supplier Part Number 1: 311-1.96KHRCT-ND; Supplier URL 1: https://www.digikey.ca/en/products/detail/yageo/RC0603FR-071K96L/726878
TP6 TP8-TP10 = Test Point (Via): Part Number: Test Point (Via)
U1 = NCP1117DT33T5G: Linear Voltage Regulator IC Positive Fixed 1 Output 1A DPAK; Part Number: NCP1117DT33T5G; Manufacturer Part Number 1: NCP1117DT33T5G; Supplier 1: Digi-Key; Supplier Part Number 1: NCP1117DT33T5GOSCT-ND; Supplier URL 1: https://www.digikey.ca/en/products/detail/onsemi/NCP1117DT33T5G/921285

## Sheet ui-jetson-nano.SchDoc
size 420 x 297 mm; SheetNumber: 4; SheetTotal: 14
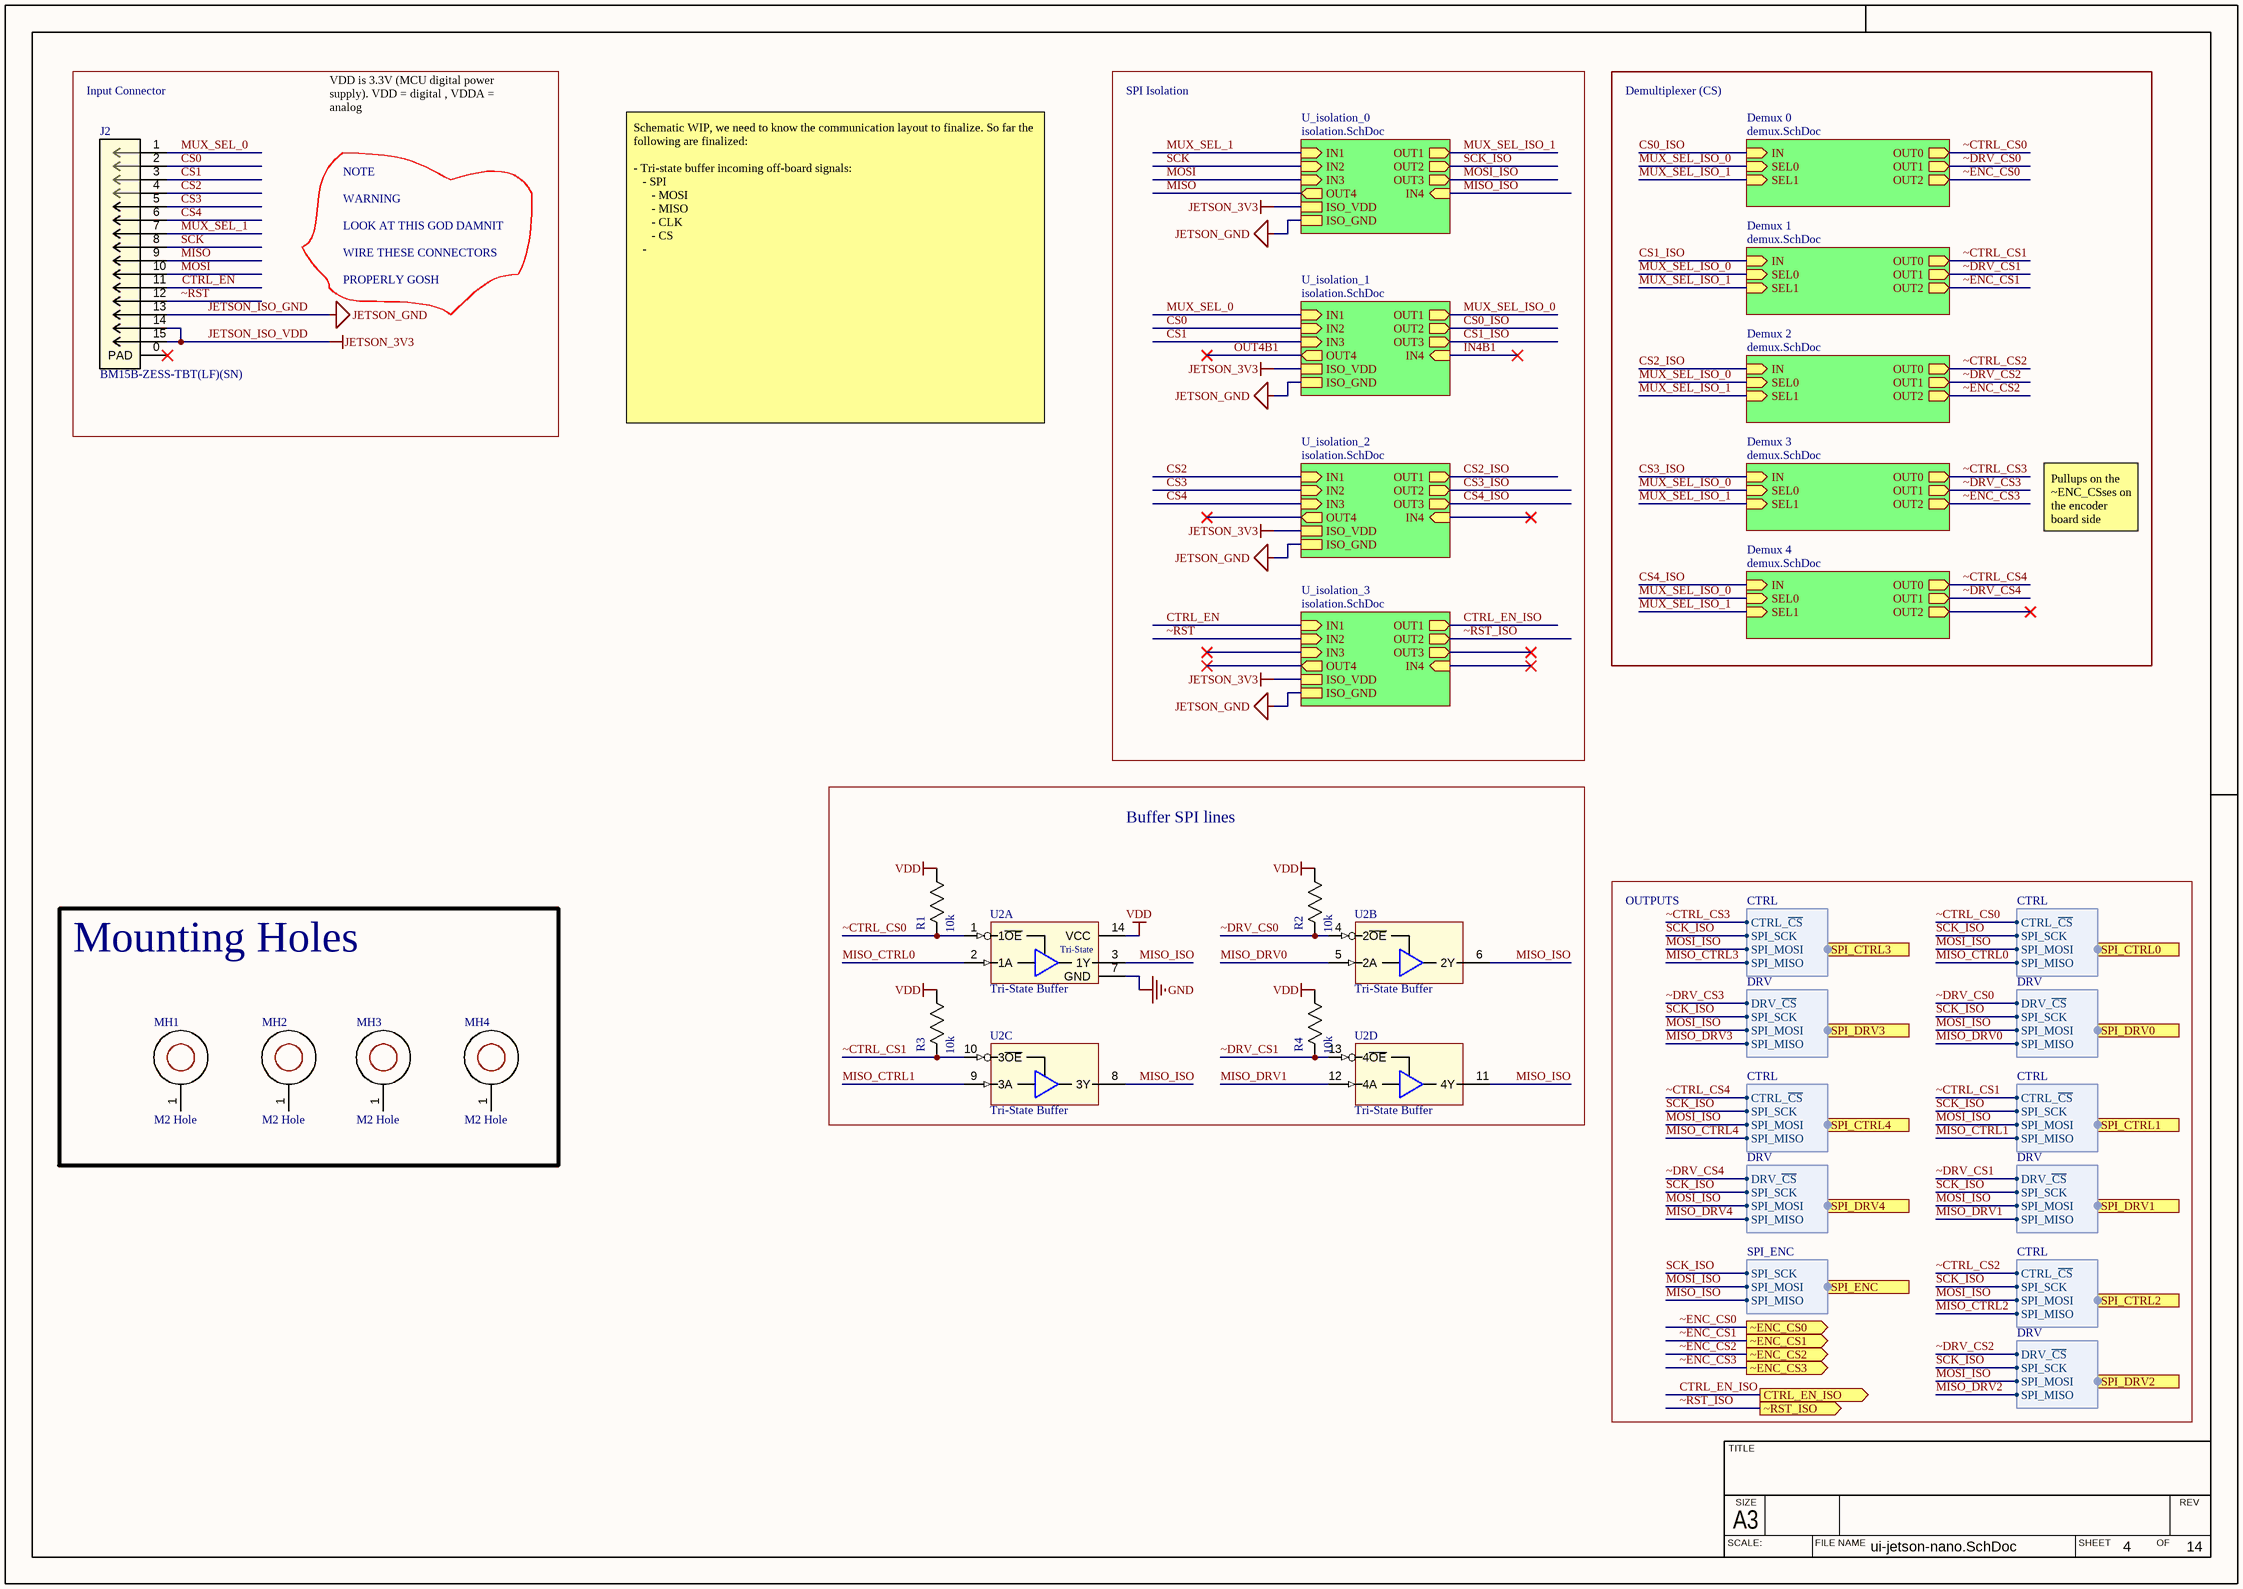
[diagram p4: ui-jetson-nano.SchDoc]

### Parts
J2  BM15B-ZESS-TBT(LF)(SN)  [JST ZE SMT 15POS]
MH1  M2 Hole  [Mounting Hole M2]  (no BOM)
MH2  M2 Hole  [Mounting Hole M2]  (no BOM)
MH3  M2 Hole  [Mounting Hole M2]  (no BOM)
MH4  M2 Hole  [Mounting Hole M2]  (no BOM)
R1  10k  [0603]
R2  10k  [0603]
R3  10k  [0603]
R4  10k  [0603]
U2  Tri-State Buffer  [14-TSSOP]  (parts A,B,C,D of 4)

### Blocks framed on the sheet
Buffer SPI lines: R1-R4 U2
Mounting Holes: MH1-MH4

### Sub-sheets
Demux 0 = demux.SchDoc (file not in this document): IN (in), SEL0 (in), SEL1 (in), OUT1 (out), OUT2 (out), OUT0 (out)
Demux 1 = demux.SchDoc (file not in this document): IN (in), SEL0 (in), SEL1 (in), OUT1 (out), OUT2 (out), OUT0 (out)
Demux 2 = demux.SchDoc (file not in this document): IN (in), SEL0 (in), SEL1 (in), OUT1 (out), OUT2 (out), OUT0 (out)
Demux 3 = demux.SchDoc (file not in this document): IN (in), SEL0 (in), SEL1 (in), OUT1 (out), OUT2 (out), OUT0 (out)
Demux 4 = demux.SchDoc (file not in this document): IN (in), SEL0 (in), SEL1 (in), OUT1 (out), OUT2 (out), OUT0 (out)
U_isolation_0 = isolation.SchDoc: OUT1 (out), IN1 (in), IN2 (in), IN3 (in), OUT4 (out), OUT3 (out), OUT2 (out), IN4 (in), ISO_VDD, ISO_GND
U_isolation_1 = isolation.SchDoc: OUT1 (out), IN1 (in), IN2 (in), IN3 (in), OUT4 (out), OUT3 (out), OUT2 (out), IN4 (in), ISO_VDD, ISO_GND
U_isolation_2 = isolation.SchDoc: OUT1 (out), IN1 (in), IN2 (in), IN3 (in), OUT4 (out), OUT3 (out), OUT2 (out), IN4 (in), ISO_VDD, ISO_GND
U_isolation_3 = isolation.SchDoc: OUT1 (out), IN1 (in), IN2 (in), IN3 (in), OUT4 (out), OUT3 (out), OUT2 (out), IN4 (in), ISO_VDD, ISO_GND

### Ports
CTRL_EN_ISO (out), SPI_CTRL0 (harness CTRL), SPI_CTRL1 (harness CTRL), SPI_CTRL2 (harness CTRL), SPI_CTRL3 (harness CTRL), SPI_CTRL4 (harness CTRL), SPI_DRV0 (harness DRV), SPI_DRV1 (harness DRV), SPI_DRV2 (harness DRV), SPI_DRV3 (harness DRV), SPI_DRV4 (harness DRV), SPI_ENC (harness SPI_ENC), ~ENC_CS0 (out), ~ENC_CS1 (out), ~ENC_CS2 (out), ~ENC_CS3 (out), ~RST_ISO (out)

### Harnesses
CTRL: SPI_SCK, SPI_MISO, SPI_MOSI, CTRL_~{CS}
DRV: SPI_SCK, SPI_MISO, SPI_MOSI, DRV_~{CS}
SPI_ENC: SPI_SCK, SPI_MISO, SPI_MOSI

### Nets
GND: U2.7(GND)
JETSON_3V3: J2.14 J2.15 ; sheet U_isolation_0/ISO_VDD, sheet U_isolation_1/ISO_VDD, sheet U_isolation_2/ISO_VDD, sheet U_isolation_3/ISO_VDD  [also labelled JETSON_ISO_VDD]
JETSON_GND: J2.13 ; sheet U_isolation_0/ISO_GND, sheet U_isolation_1/ISO_GND, sheet U_isolation_2/ISO_GND, sheet U_isolation_3/ISO_GND  [also labelled JETSON_ISO_GND]
VDD: R1.1(R1) R2.1(R1) R3.1(R1) R4.1(R1) U2.14(VCC)
CS0: J2.2 ; sheet U_isolation_1/IN2
CS0_ISO: sheet U_isolation_1/OUT2, sheet Demux 0/IN
CS1: J2.3 ; sheet U_isolation_1/IN3
CS1_ISO: sheet U_isolation_1/OUT3, sheet Demux 1/IN
CS2: J2.4 ; sheet U_isolation_2/IN1
CS2_ISO: sheet U_isolation_2/OUT1, sheet Demux 2/IN
CS3: J2.5 ; sheet U_isolation_2/IN2
CS3_ISO: sheet U_isolation_2/OUT2, sheet Demux 3/IN
CS4: J2.6 ; sheet U_isolation_2/IN3
CS4_ISO: sheet U_isolation_2/OUT3, sheet Demux 4/IN
CTRL_EN: J2.11 ; sheet U_isolation_3/IN1
CTRL_EN_ISO: port CTRL_EN_ISO, sheet U_isolation_3/OUT1
MISO: J2.9 ; sheet U_isolation_0/OUT4
MISO_CTRL0: U2.2(1A) ; port SPI_CTRL0.SPI_MISO
MISO_CTRL1: U2.9(3A) ; port SPI_CTRL1.SPI_MISO
MISO_CTRL2: port SPI_CTRL2.SPI_MISO
MISO_CTRL3: port SPI_CTRL3.SPI_MISO
MISO_DRV0: U2.5(2A) ; port SPI_DRV0.SPI_MISO
MISO_DRV1: U2.12(4A) ; port SPI_DRV1.SPI_MISO
MISO_DRV4: port SPI_DRV4.SPI_MISO
MISO_ISO: U2.3(1Y) U2.6(2Y) U2.8(3Y) U2.11(4Y) ; sheet U_isolation_0/IN4, port SPI_ENC.SPI_MISO
MOSI: J2.10 ; sheet U_isolation_0/IN3
MOSI_ISO: sheet U_isolation_0/OUT3, port SPI_CTRL0.SPI_MOSI, port SPI_DRV0.SPI_MOSI, port SPI_ENC.SPI_MOSI, port SPI_CTRL1.SPI_MOSI, port SPI_DRV1.SPI_MOSI, port SPI_CTRL2.SPI_MOSI, port SPI_DRV2.SPI_MOSI, port SPI_CTRL3.SPI_MOSI, port SPI_DRV3.SPI_MOSI, port SPI_CTRL4.SPI_MOSI, port SPI_DRV4.SPI_MOSI
MUX_SEL_0: J2.1 ; sheet U_isolation_1/IN1
MUX_SEL_1: J2.7 ; sheet U_isolation_0/IN1
MUX_SEL_ISO_0: sheet U_isolation_1/OUT1, sheet Demux 0/SEL0, sheet Demux 1/SEL0, sheet Demux 2/SEL0, sheet Demux 3/SEL0, sheet Demux 4/SEL0
MUX_SEL_ISO_1: sheet U_isolation_0/OUT1, sheet Demux 0/SEL1, sheet Demux 1/SEL1, sheet Demux 2/SEL1, sheet Demux 3/SEL1, sheet Demux 4/SEL1
SCK: J2.8 ; sheet U_isolation_0/IN2
SCK_ISO: sheet U_isolation_0/OUT2, port SPI_CTRL0.SPI_SCK, port SPI_DRV0.SPI_SCK, port SPI_ENC.SPI_SCK, port SPI_CTRL1.SPI_SCK, port SPI_DRV1.SPI_SCK, port SPI_CTRL2.SPI_SCK, port SPI_DRV2.SPI_SCK, port SPI_CTRL3.SPI_SCK, port SPI_DRV3.SPI_SCK, port SPI_CTRL4.SPI_SCK, port SPI_DRV4.SPI_SCK
~CTRL_CS0: R1.2(R2) U2.1(1~{OE}) ; sheet Demux 0/OUT0, port SPI_CTRL0.CTRL_~{CS}  [project net SPI_CTRL0.CTRL_~{CS}]
~CTRL_CS1: R3.2(R2) U2.10(3~{OE}) ; sheet Demux 1/OUT0, port SPI_CTRL1.CTRL_~{CS}  [project net SPI_CTRL1.CTRL_~{CS}]
~CTRL_CS2: sheet Demux 2/OUT0, port SPI_CTRL2.CTRL_~{CS}  [project net SPI_CTRL2.CTRL_~{CS}]
~CTRL_CS3: sheet Demux 3/OUT0, port SPI_CTRL3.CTRL_~{CS}  [project net SPI_CTRL3.CTRL_~{CS}]
~CTRL_CS4: sheet Demux 4/OUT0, port SPI_CTRL4.CTRL_~{CS}  [project net CTRL_~{CS}E]
~DRV_CS0: R2.2(R2) U2.4(2~{OE}) ; sheet Demux 0/OUT1, port SPI_DRV0.DRV_~{CS}  [project net DRV_~{CS}]
~DRV_CS1: R4.2(R2) U2.13(4~{OE}) ; sheet Demux 1/OUT1, port SPI_DRV1.DRV_~{CS}  [project net DRV_~{CS}]
~DRV_CS2: sheet Demux 2/OUT1, port SPI_DRV2.DRV_~{CS}  [project net DRV_~{CS}_Driver Power Stage 2]
~DRV_CS3: sheet Demux 3/OUT1, port SPI_DRV3.DRV_~{CS}  [project net DRV_~{CS}_Driver Power Stage 3]
~DRV_CS4: sheet Demux 4/OUT1, port SPI_DRV4.DRV_~{CS}  [project net SPI_DRV4.DRV_~{CS}]
~ENC_CS0: port ~ENC_CS0, sheet Demux 0/OUT2
~ENC_CS1: port ~ENC_CS1, sheet Demux 1/OUT2
~ENC_CS2: port ~ENC_CS2, sheet Demux 2/OUT2
~ENC_CS3: port ~ENC_CS3, sheet Demux 3/OUT2
~RST: J2.12 ; sheet U_isolation_3/IN2
~RST_ISO: port ~RST_ISO, sheet U_isolation_3/OUT2

Not connected (* = marked no-connect by the designer): J2 0(PAD)*; MH1 1; MH2 1; MH3 1; MH4 1

### Notes on the sheet
- Input Connector
- SPI Isolation
- Demultiplexer (CS)
- VDD is 3.3V (MCU digital power supply). VDD = digital , VDDA = analog
- NOTE
- WARNING
- LOOK AT THIS GOD DAMNIT
- WIRE THESE CONNECTORS
- PROPERLY GOSH
- Schematic WIP, we need to know the communication layout to finalize. So far the following are finalized:
  - Tri-state buffer incoming off-board signals:
  - SPI
  - MOSI
  - MISO
  - CLK
  - CS
  -
- Pullups on the ~ENC_CSses on the encoder board side
- OUTPUTS
- TITLE
- SCALE:
- A3
- SIZE
- FILE NAME
- SHEET
- OF
- REV
- (in symbol SN74LVC125APWR, part A) Tri-State

### Library data of the parts
J2 = CN 15POS JST ZE SMT: CONN HEADER VERT SMD 15POS ZE; Supplier 1: Digi-Key; Supplier Part Number 1: 455-4211-1-ND; Part Number: CN 15POS JST ZE SMT; Supplier URL 1: https://www.digikey.ca/en/products/detail/jst-sales-america-inc/BM15B-ZESS-TBT-LF-SN/1886999?s=N4IgTCBcDaIEIFkCMBWOBaAWgUQMq-QBU5CAKAGQDEBKU3AOWpAF0BfIA; Pin Count: 15; Manufacturer Part Number 1: BM15B-ZESS-TBT(LF)(SN)
MH1-MH4 = MOUNTING HOLE M2: Standard M2 Mounting Hole for M2 Standoff; Part Number: MOUNTING HOLE M2
R1-R4 = RES 10k 1/8W 1%: RES SMD 10K OHM 1% 1/8W 0805; Manufacturer Part Number 1: ERJ-H3GJ103V; Power (Watts): 0.125W; Tolerance: 5%; Package: 0805; Value: 10k; Part Number: RES 10k 1/8W 1%; Supplier 1: Digi-Key; Supplier Part Number 1: 10-ERJ-H3GJ103VCT-ND; Manufacturer Part Number 2: RMCF0805JT10K0; Supplier 2: Digi-Key; Supplier Part Number 2: RMCF0805JT10K0CT-ND; Tolerance 2: 5%; Supplier URL 1: https://www.digikey.ca/en/products/detail/panasonic-electronic-components/ERJ-H3GJ103V/13877876?s=N4IgTCBcDaIIwAYC0BRASgKSQCQMwHENFcA1AYQBUkA5AERAF0BfIA; Supplier URL 2: https://www.digikey.ca/en/products/detail/stackpole-electronics-inc/RMCF0805JT10K0/1757762?s=N4IgTCBcDaIEoFkDCAxADADjQVgFIBUBGNAaTSXxAF0BfIA
U2 = SN74LVC125APWR: Buffer, Non-Inverting 4 Element 1 Bit per Element 3-State Output 14-TSSOP; Part Number: SN74LVC125APWR; Supplier 1: Digi-Key; Supplier Part Number 1: 296-1222-1-ND; Supplier URL 1: https://www.digikey.ca/en/products/detail/texas-instruments/SN74LVC125APWR/276865; Manufacturer Part Number 1: SN74LVC125APWR

## Sheet isolation.SchDoc
size A4; SheetNumber: 4; SheetTotal: 14
Used 4 times, as channels UI-JETSON-NANO/U_isolation_0, UI-JETSON-NANO/U_isolation_1, UI-JETSON-NANO/U_isolation_2, UI-JETSON-NANO/U_isolation_3. Parts and nets are listed once, with the designators drawn on the sheet.
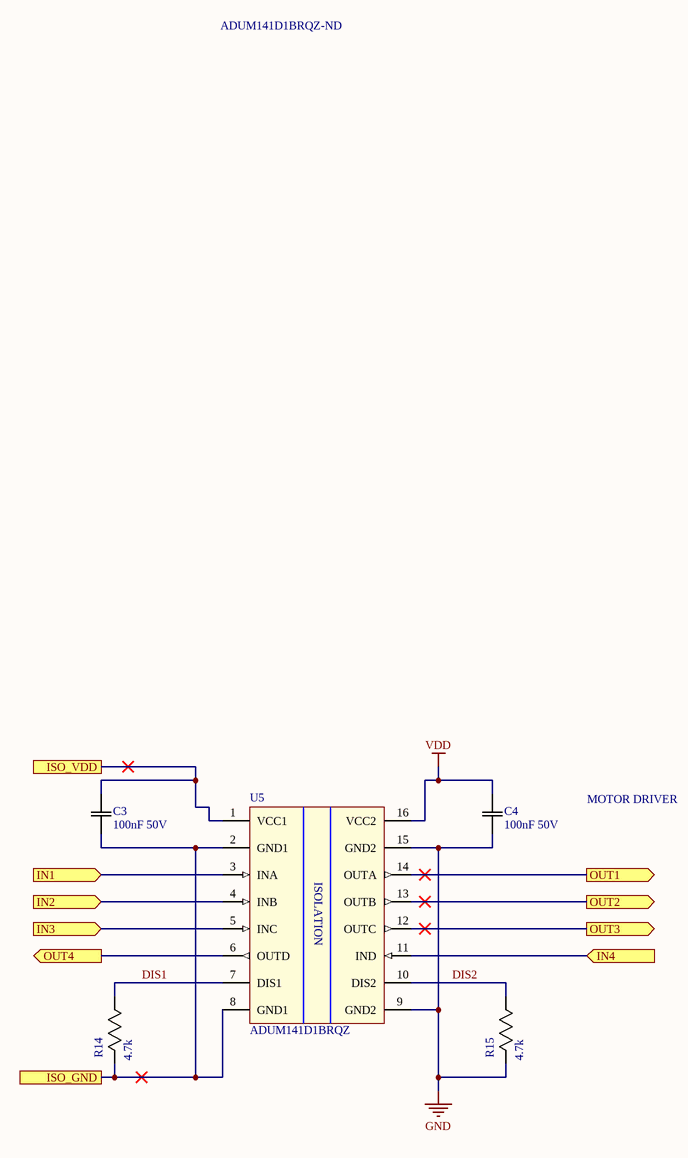
[diagram p5: isolation.SchDoc]

### Parts
C3  100nF 50V  [0603]
C4  100nF 50V  [0603]
R14  4.7k  [0603]
R15  4.7k  [0603]
U5  ADUM141D1BRQZ  Supplier Part Number 1: ADUM141D1BRQZ-ND  [SOP64P600X175-16N]

### Ports
IN1 (in), IN2 (in), IN3 (in), IN4 (in), ISO_GND, ISO_VDD, OUT1 (out), OUT2 (out), OUT3 (out), OUT4 (out)

### Nets
GND: C4.1(C1) R15.2(R2) U5.9(GND2) U5.15(GND2)
VDD: C4.2(C2) U5.16(VCC2)
DIS1: R14.1(R1) U5.7(DIS1)
DIS2: R15.1(R1) U5.10(DIS2)
IN1: U5.3(INA) ; port IN1
IN2: U5.4(INB) ; port IN2
IN3: U5.5(INC) ; port IN3
IN4: U5.11(IND) ; port IN4
ISO_GND: C3.1(C1) R14.2(R2) U5.2(GND1) U5.8(GND1) ; port ISO_GND
ISO_VDD: C3.2(C2) U5.1(VCC1) ; port ISO_VDD
OUT1: U5.14(OUTA) ; port OUT1
OUT2: U5.13(OUTB) ; port OUT2
OUT3: U5.12(OUTC) ; port OUT3
OUT4: U5.6(OUTD) ; port OUT4

### Channels
UI-JETSON-NANO/U_isolation_0: designators end in A; ports IN1=MUX_SEL_1 IN2=SCK IN3=MOSI IN4=MISO_ISO ISO_GND=JETSON_GND ISO_VDD=JETSON_3V3 OUT1=MUX_SEL_ISO_1 OUT2=SCK_ISO OUT3=MOSI_ISO OUT4=MISO
UI-JETSON-NANO/U_isolation_1: designators end in B; ports IN1=MUX_SEL_0 IN2=CS0 IN3=CS1 IN4=IN4B1 ISO_GND=JETSON_GND ISO_VDD=JETSON_3V3 OUT1=MUX_SEL_ISO_0 OUT2=CS0_ISO OUT3=CS1_ISO OUT4=OUT4B1
UI-JETSON-NANO/U_isolation_2: designators end in C; ports IN1=CS2 IN2=CS3 IN3=CS4 IN4=IN4_U_isolation_2 ISO_GND=JETSON_GND ISO_VDD=JETSON_3V3 OUT1=CS2_ISO OUT2=CS3_ISO OUT3=CS4_ISO OUT4=OUT4_U_isolation_2
UI-JETSON-NANO/U_isolation_3: designators end in D; ports IN1=CTRL_EN IN2=~RST IN3=IN3_U_isolation_3 IN4=IN4_U_isolation_3 ISO_GND=JETSON_GND ISO_VDD=JETSON_3V3 OUT1=CTRL_EN_ISO OUT2=~RST_ISO OUT3=OUT3_U_isolation_3 OUT4=OUT4_U_isolation_3

### Notes on the sheet
- MOTOR DRIVER
- (in symbol ISO ADUM141D1BRQZ) ISOLATION

### Library data of the parts
C3 C4 = CAP 100nF 50V: Default Symbol for Capacitors; Manufacturer Part Number 1: CC0603KPX7R9BB104; Temperature Coefficient: X7R; Tolerance: 10%; Part Number: CAP 100nF 50V; Supplier 1: Digi-Key; Supplier Part Number 1: 311-3567-1-ND; Manufacturer Part Number 2: 0805J0500104KJT; Supplier 2: Digi-Key; Supplier Part Number 2: 1608-1458-1-ND; Value: 100nF; Rating: 50V
R14 R15 = RES 4.7k 1/8W - 5%: Default Resistor Symbol; Manufacturer Part Number 1: RMCF0603JT4K70; Power (Watts): 0.125W; Tolerance: 5%; Package: 0805; Value: 4.7k; Part Number: RES 4.7k 1/8W - 5%; Supplier 1: Digi-Key; Supplier Part Number 1: RMCF0603JT4K70CT-ND; Supplier URL 1: https://www.digikey.ca/en/products/detail/stackpole-electronics-inc/RMCF0603JT4K70/1757976
U5 = ISO ADUM141D1BRQZ: Digital Isolator CMOS 4-CH 150Mbps 16-Pin QSOP T/R; Supplier 1: Digi-Key; Part Number: ISO ADUM141D1BRQZ; Supplier URL 1: https://www.digikey.ca/en/products/detail/analog-devices-inc/ADUM141D1BRQZ/7606661; Manufacturer Part Number 1: ADUM141D1BRQZ

## Sheet trinamic-controller-dribbler.SchDoc
size B; SheetNumber: 8; SheetTotal: 14
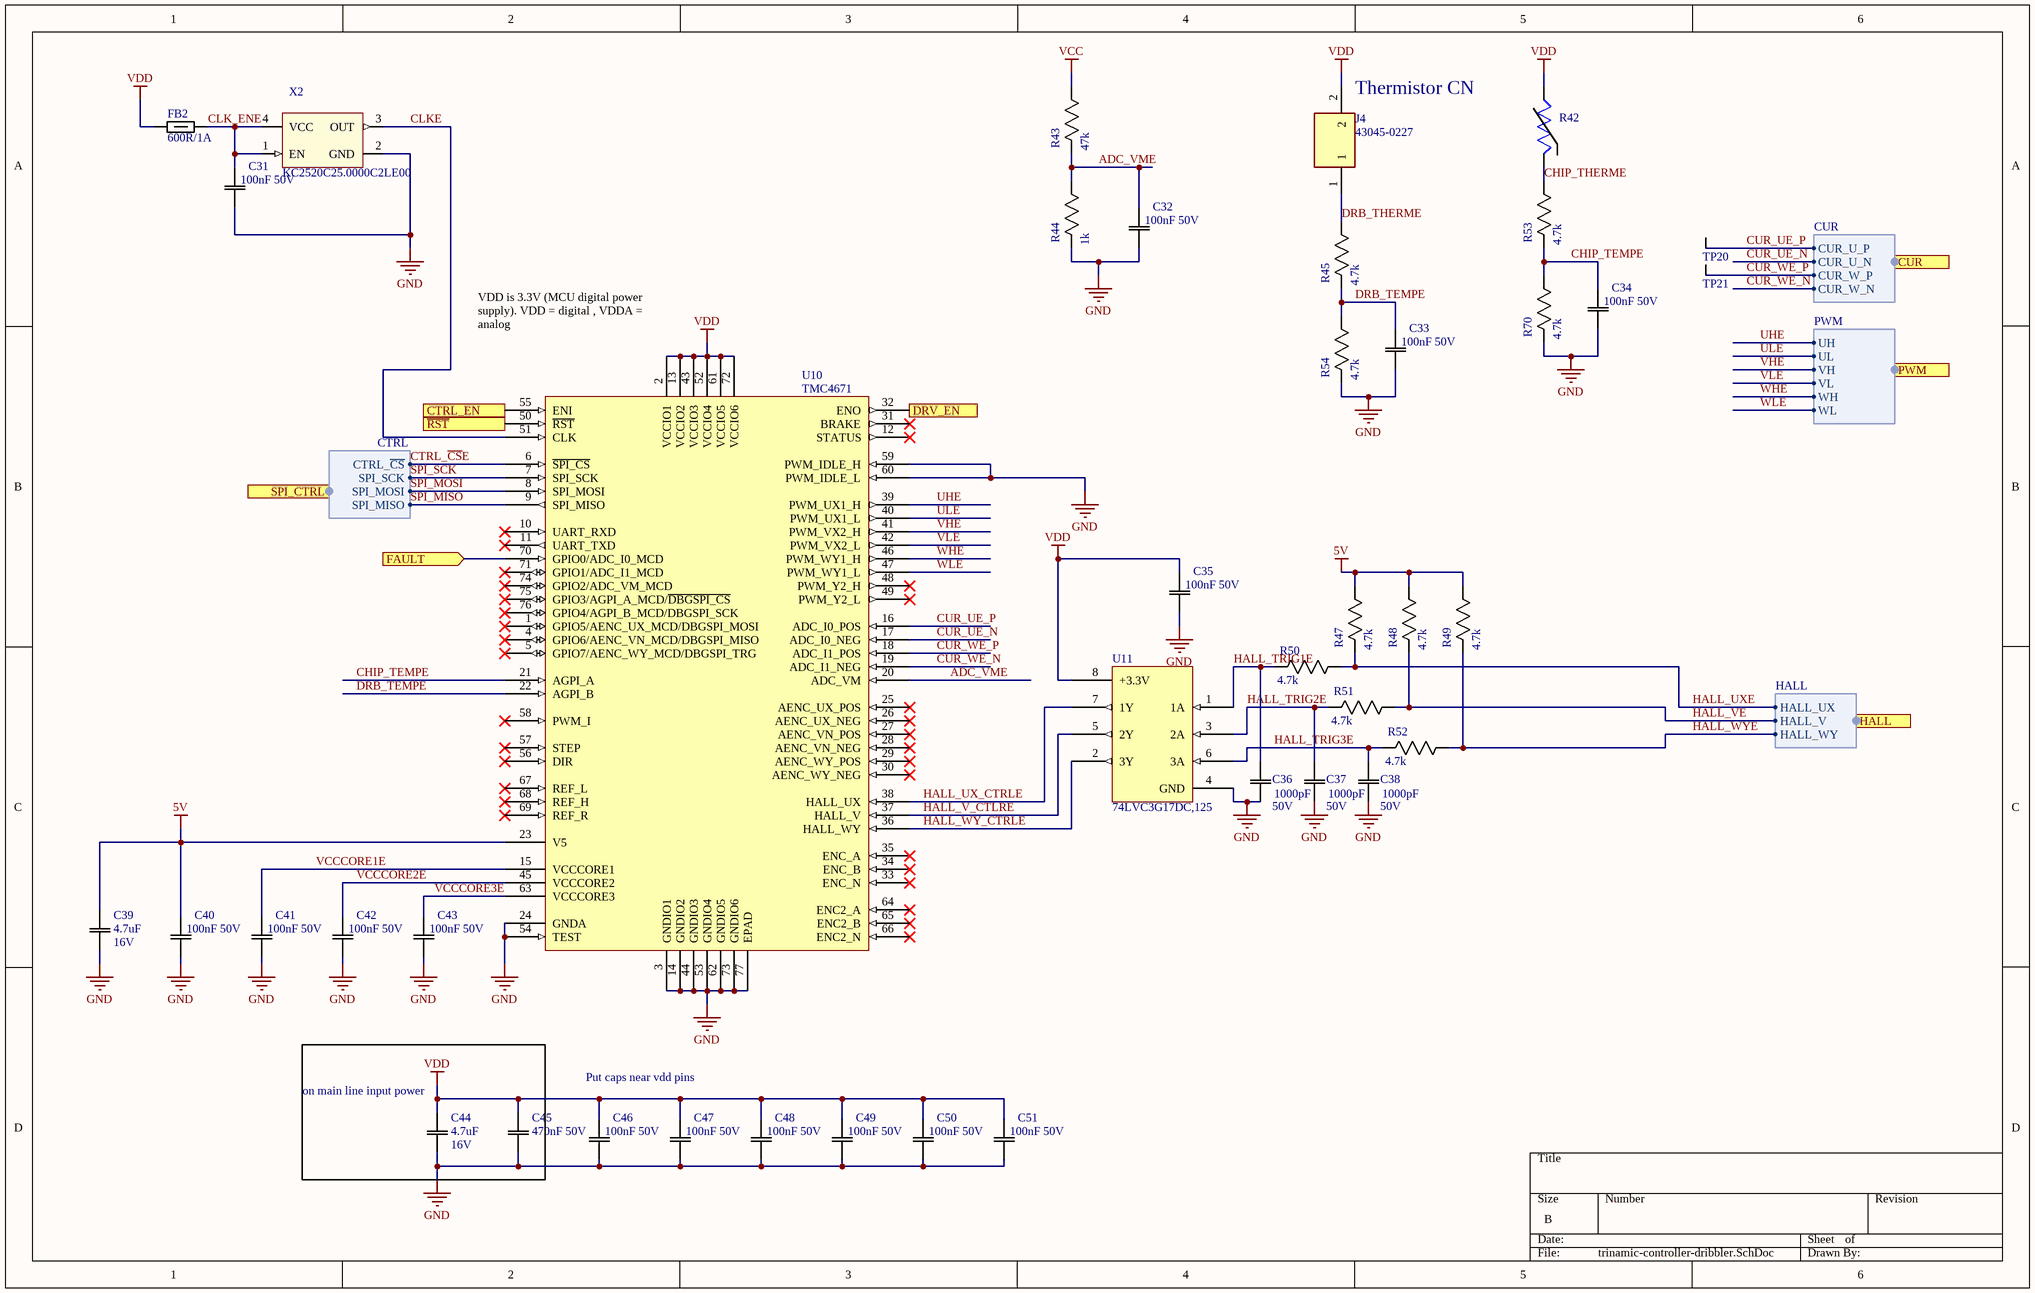
[diagram p6: trinamic-controller-dribbler.SchDoc]

### Parts
C31  100nF 50V  [0603]
C32  100nF 50V  [0603]
C33  100nF 50V  [0603]
C34  100nF 50V  [0603]
C35  100nF 50V  [0603]
C36  value 1000pF  Rating: 50V  [0603]  (hidden comment: 1000pF 50V)
C37  value 1000pF  Rating: 50V  [0603]  (hidden comment: 1000pF 50V)
C38  value 1000pF  Rating: 50V  [0603]  (hidden comment: 1000pF 50V)
C39  value 4.7uF  Rating: 16V  [0603]  (hidden comment: 4.7uF 16V)
C40  100nF 50V  [0603]
C41  100nF 50V  [0603]
C42  100nF 50V  [0603]
C43  100nF 50V  [0603]
C44  value 4.7uF  Rating: 16V  [0603]  (hidden comment: 4.7uF 16V)
C45  470nF 50V  [0603]
C46  100nF 50V  [0603]
C47  100nF 50V  [0603]
C48  100nF 50V  [0603]
C49  100nF 50V  [0603]
C50  100nF 50V  [0603]
C51  100nF 50V  [0603]
FB2  600R/1A  [0603]
J4  43045-0227  [MOLEX_0430450227]
R42  RES NTC 10k  [0603]  (value not drawn)
R43  47k  [0603]
R44  1k  [0603]
R45  4.7k  [0603]
R47  4.7k  [0603]
R48  4.7k  [0603]
R49  4.7k  [0603]
R50  4.7k  [0603]
R51  4.7k  [0603]
R52  4.7k  [0603]
R53  4.7k  [0603]
R54  4.7k  [0603]
R70  4.7k  [0603]
TP20  C_UE  [TP]  (value not drawn)  (no BOM)
TP21  C_WE  [TP]  (value not drawn)  (no BOM)
U10  TMC4671  [QFN40P1050X650X90_HS-77N]
U11  74LVC3G17DC,125  [8-VSSOP]
X2  KC2520C25.0000C2LE00  [KC2520C25.0000C2LE00]

### Blocks framed on the sheet
on main line input power: C44 C45

### Ports
CTRL_EN (in), CUR (harness CUR), DRV_EN (out), FAULT (in), HALL (harness HALL), PWM (harness PWM), SPI_CTRL (harness CTRL), ~{RST} (in)

### Harnesses
PWM: VL, WH, WL, VH, UL, UH
CTRL: SPI_SCK, SPI_MISO, SPI_MOSI, CTRL_~{CS}
CUR: CUR_U_P, CUR_W_P, CUR_U_N, CUR_W_N
HALL: HALL_UX, HALL_WY, HALL_V

### Nets
5V: C39.2(C2) C40.2(C2) R47.1(R1) R48.1(R1) R49.1(R1) U10.23(V5)
GND: C31.1(C1) C32.1(C1) C33.1(C1) C34.1(C1) C35.1(C1) C36.1(C1) C37.1(C1) C38.1(C1) C39.1(C1) C40.1(C1) C41.1(C1) C42.1(C1) C43.1(C1) C44.1(C1) C45.1(C1) C46.1(C1) C47.1(C1) C48.1(C1) C49.1(C1) C50.1(C1) C51.1(C1) R44.2(R2) R54.2(R2) R70.2(R2) U10.3(GNDIO1) U10.14(GNDIO2) U10.24(GNDA) U10.44(GNDIO3) U10.53(GNDIO4) U10.54(TEST) U10.59(PWM_IDLE_H) U10.60(PWM_IDLE_L) U10.62(GNDIO5) U10.73(GNDIO6) U10.77(EPAD) U11.4(GND) X2.2(GND)
VCC: R43.1(R1)
VDD: C35.2(C2) C44.2(C2) C45.2(C2) C46.2(C2) C47.2(C2) C48.2(C2) C49.2(C2) C50.2(C2) C51.2(C2) FB2.1 J4.2 R42.2 U10.2(VCCIO1) U10.13(VCCIO2) U10.43(VCCIO3) U10.52(VCCIO4) U10.61(VCCIO5) U10.72(VCCIO6) U11.8(+3.3V)
ADC_VME: C32.2(C2) R43.2(R2) R44.1(R1) U10.20(ADC_VM)
CHIP_TEMPE: C34.2(C2) R53.2(R2) R70.1(R1) U10.21(AGPI_A)
CHIP_THERME: R42.1 R53.1(R1)
CLK_ENE: C31.2(C2) FB2.2 X2.1(EN) X2.4(VCC)
CLKE: U10.51(CLK) X2.3(OUT)
CTRL_~{CS}E: U10.6(~{SPI_CS}) ; port SPI_CTRL.CTRL_~{CS}
CTRL_EN_ISO: U10.55(ENI) ; port CTRL_EN
CUR_UE_N: U10.17(ADC_I0_NEG) ; port CUR.CUR_U_N
CUR_UE_P: TP20.1 U10.16(ADC_I0_POS) ; port CUR.CUR_U_P
CUR_WE_N: U10.19(ADC_I1_NEG) ; port CUR.CUR_W_N
CUR_WE_P: TP21.1 U10.18(ADC_I1_POS) ; port CUR.CUR_W_P
DRB_TEMPE: C33.2(C2) R45.2(R2) R54.1(R1) U10.22(AGPI_B)
DRB_THERME: J4.1 R45.1(R1)
DRV_EN: U10.32(ENO) ; port DRV_EN
FAULT: U10.70(GPIO0/ADC_I0_MCD) ; port FAULT
HALL_TRIG1E: C36.2(C2) R50.2(R2) U11.1(1A)
HALL_TRIG2E: C37.2(C2) R51.2(R2) U11.3(2A)
HALL_TRIG3E: C38.2(C2) R52.2(R2) U11.6(3A)
HALL_UX_CTRLE: U10.38(HALL_UX) U11.7(1Y)
HALL_UXE: R47.2(R2) R50.1(R1) ; port HALL.HALL_UX
HALL_V_CTLRE: U10.37(HALL_V) U11.5(2Y)
HALL_VE: R48.2(R2) R51.1(R1) ; port HALL.HALL_V
HALL_WY_CTRLE: U10.36(HALL_WY) U11.2(3Y)
HALL_WYE: R49.2(R2) R52.1(R1) ; port HALL.HALL_WY
SPI_MISO: U10.9(SPI_MISO) ; port SPI_CTRL.SPI_MISO  [project net MISO_CTRL4]
SPI_MOSI: U10.8(SPI_MOSI) ; port SPI_CTRL.SPI_MOSI  [project net MOSI_ISO]
SPI_SCK: U10.7(SPI_SCK) ; port SPI_CTRL.SPI_SCK  [project net SCK_ISO]
UHE: U10.39(PWM_UX1_H) ; port PWM.UH
ULE: U10.40(PWM_UX1_L) ; port PWM.UL
VCCCORE1E: C41.2(C2) U10.15(VCCCORE1)
VCCCORE2E: C42.2(C2) U10.45(VCCCORE2)
VCCCORE3E: C43.2(C2) U10.63(VCCCORE3)
VHE: U10.41(PWM_VX2_H) ; port PWM.VH
VLE: U10.42(PWM_VX2_L) ; port PWM.VL
WHE: U10.46(PWM_WY1_H) ; port PWM.WH
WLE: U10.47(PWM_WY1_L) ; port PWM.WL
~RST_ISO: U10.50(~{RST}) ; port ~{RST}

Not connected (* = marked no-connect by the designer): U10 1(GPIO5/AENC_UX_MCD/DBGSPI_MOSI)* 4(GPIO6/AENC_VN_MCD/DBGSPI_MISO)* 5(GPIO7/AENC_WY_MCD/DBGSPI_TRG)* 10(UART_RXD)* 11(UART_TXD)* 12(STATUS)* 25(AENC_UX_POS)* 26(AENC_UX_NEG)* 27(AENC_VN_POS)* 28(AENC_VN_NEG)* 29(AENC_WY_POS)* 30(AENC_WY_NEG)* 31(BRAKE)* 33(ENC_N)* 34(ENC_B)* 35(ENC_A)* 48(PWM_Y2_H)* 49(PWM_Y2_L)* 56(DIR)* 57(STEP)* 58(PWM_I)* 64(ENC2_A)* 65(ENC2_B)* 66(ENC2_N)* 67(REF_L)* 68(REF_H)* 69(REF_R)* 71(GPIO1/ADC_I1_MCD)* 74(GPIO2/ADC_VM_MCD)* 75(GPIO3/AGPI_A_MCD/~{DBGSPI_CS})* 76(GPIO4/AGPI_B_MCD/DBGSPI_SCK)*

### Notes on the sheet
- (near J4) Thermistor CN
- (near U10) VDD is 3.3V (MCU digital power supply). VDD = digital , VDDA = analog
- Put caps near vdd pins

### Library data of the parts
C31-C35 C40-C43 C46-C51 = CAP 100nF 50V: as C60 on sheet driver-power-stage; VALUE: 100nF; Rating: 50V; Part Number: CAP 100nF 50V; Supplier 1: Digi-Key; Supplier Part Number 1: 311-3567-1-ND; Manufacturer Part Number 2: 0805J0500104KJT; Supplier 2: Digi-Key; Supplier Part Number 2: 1608-1458-1-ND
C36-C38 = CAP 1000pF 50V: Default Symbol for Capacitors; Manufacturer Part Number 1: 06035C102K4Z2A / 06035C102K4Z2A; Tolerance: 10%; Temperature Coefficient: X7R; Part Number: CAP 1000pF 50V; Supplier 1: Digi-Key; Supplier Part Number 1: 478-6342-1-ND; Manufacturer Part Number 2: 08055C102KAT2A; Supplier 2: Digi-Key; Supplier Part Number 2: 478-1371-1-ND
C39 C44 = CAP 4.7uF 16V: Default Symbol for Capacitors; Manufacturer Part Number 1: C1608X5R1C475K080AE; Tolerance: 10%; Temperature Coefficient: X5R; Part Number: CAP 4.7uF 16V; Supplier 1: Digi-Key; Supplier Part Number 1: 445-175225-1-ND; Manufacturer Part Number 2: C2012X5R1C475K085AB; Supplier 2: Digi-Key; Supplier Part Number 2: 445-14382-1-ND
C45 = CAP 470nF 50V: as C61 on sheet driver-power-stage; VALUE: 470nF; Rating: 50V; Part Number: CAP 470nF 50V; Supplier 1: Digi-Key; Supplier Part Number 1: 445-5952-1-ND; Manufacturer Part Number 2: CL21B474KBFNNNG; Supplier 2: Digi-Key; Supplier Part Number 2: 1276-6482-1-ND
FB2 = FERRITE BEAD 200 MOHM 0603 1LN: WURTH ELEKTRONIK - 742792651 - Ferrite Bead, 0603 [1608 Metric], 600 ohm, 1 A, WE-CBF Series, 0.2 ohm, &#177; 25%; VALUE: 600R/1A @ 100 MHz; Supplier 1: Digi-Key; Supplier Part Number 1: 732-1593-1-ND; Part Number: FERRITE BEAD 200 MOHM 0603 1LN; Supplier URL 1: https://www.digikey.ca/en/products/detail/w%C3%BCrth-elektronik/742792651/1638997?s=N4IgTCBcDaIOwGYwFoCMBWAnAtyByAIiALoC%2BQA; Manufacturer Part Number 1: 742792651
J4 = CN HDR 2POS Molex 43045-0227: Molex 43045-0227 2POS Microfit / dual row, Vertical; Manufacturer Part Number 1: 0430450227; Part Number: CN HDR 2POS Molex 43045-0227; Supplier 1: Digi-Key; Supplier Part Number 1: WM10657-ND / WM10657-ND / WM10657-ND; Supplier URL 1: https://www.digikey.ca/en/products/detail/molex/0430450227/3310182?s=N4IgTCBcDaICwGYAMcCsSxgOwgLoF8g; Pin Count: 2
R42 = RES NTC 10k CHIP: Manufacturer Part Number 1: NCU18XH103F60RB; Tolerance: 1%; Part Number: RES NTC 10k CHIP; VALUE: 10k; Supplier 1: Digi-Key; Supplier Part Number 1: 490-16279-1-ND; Supplier URL 1: https://www.digikey.ca/en/products/detail/murata-electronics/NCU18XH103F60RB/7363023?s=N4IgTCBcDaICwE4AMBaAjANjAdgelAcgCIgC6AvkA
R43 = RES 47k 1/8W - 1%: Default Resistor Symbol; Manufacturer Part Number 1: MCT06030C4702FP500; Power (Watts): 0.125W; Tolerance: 1%; Package: 0805; VALUE: 47k; Part Number: RES 47k 1/8W - 1%; Supplier 1: Digi-Key; Supplier Part Number 1: MCT0603-47.0K-CFCT-ND; Manufacturer Part Number 2: AC0805FR-0747KL; Supplier 2: Digi-Key; Supplier Part Number 2: YAG3735CT-ND; Tolerance 2: 1%; Supplier URL 1: https://www.digikey.ca/en/products/detail/vishay-beyschlag-draloric-bc-components/MCT06030C4702FP500/2607854?s=N4IgTCBcDaILIGEAqAGAbCgzAWgCwHYA6FAaWwQDFlsA5AERAF0BfIA; Supplier URL 2: https://www.digikey.ca/en/products/detail/yageo/AC0805FR-0747KL/5896858?s=N4IgTCBcDaIJoEEDiBmA7CgrAYQCoFoA5AERAF0BfIA
R44 = RES 1k 1/8W - 1%: Default Resistor Symbol; Manufacturer Part Number 1: MCT06030C1001FP500; Power (Watts): 0.125W; Tolerance: 1%; Package: 0805; VALUE: 1k; Part Number: RES 1k 1/8W - 1%; Supplier 1: Digi-Key; Supplier Part Number 1: MCT0603-1.00K-CFCT-ND; Manufacturer Part Number 2: RMCF0805FT1K00; Supplier 2: Digi-Key; Supplier Part Number 2: RMCF0805FT1K00CT-ND; Tolerance 2: 1%; Supplier URL 1: https://www.digikey.ca/en/products/detail/vishay-beyschlag-draloric-bc-components/MCT06030C1001FP500/2607821?s=N4IgTCBcDaILIGEAqAGAbCgzAWgIwDoUUBpbBAMWWwDkAREAXQF8g; Supplier URL 2: https://www.digikey.ca/en/products/detail/stackpole-electronics-inc/RMCF0805FT1K00/1760090?s=N4IgTCBcDaIEoFkDCAxADADjQVhQFQEYBpNNJPEAXQF8g
R45 R53 R54 R70 = RES 4.7k 1/8W - 1%: Default Resistor Symbol; Manufacturer Part Number 1: RMCF0603FT4K70; Power (Watts): 0.125W; Tolerance: 1%; Package: 0805; VALUE: 4.7k; Part Number: RES 4.7k 1/8W - 1%; Supplier 1: Digi-Key; Supplier Part Number 1: RMCF0603FT4K70CT-ND; Supplier URL 1: https://www.digikey.ca/en/products/detail/stackpole-electronics-inc/RMCF0603FT4K70/1760998
R47-R52 = RES 4.7k 1/8W - 5%: as R14 on sheet isolation; Package: 0805; VALUE: 4.7k; Part Number: RES 4.7k 1/8W - 5%; Supplier 1: Digi-Key; Supplier Part Number 1: RMCF0603JT4K70CT-ND; Supplier URL 1: https://www.digikey.ca/en/products/detail/stackpole-electronics-inc/RMCF0603JT4K70/1757976
TP20 TP21 = Test Point (Via): Part Number: Test Point (Via)
U10 = TMC4671: Motor Driver, -40 To 125Deg C Rohs Compliant: Yes; Manufacturer Part Number 1: TMC4671-LA; Supplier 1: Digi-Key; Supplier Part Number 1: 1460-TMC4671-LA-ND; Part Number: TMC4671; Supplier URL 1: https://www.digikey.ca/en/products/detail/trinamic-motion-control-gmbh/TMC4671-LA/12174669?s=N4IgTCBcDaIIwBYBsAGAtAFQLIGFkHY40AZAQTQDkAREAXQF8g
U11 = IC 74LVC3G17DC,125: IC BUFFER TRIPLE SCHMITT TRIGGER 5.5V VSSOP-8; Supplier 1: Newark; Supplier Part Number 1: 33AC1281; Part Number: IC 74LVC3G17DC,125; Supplier URL 1: https://canada.newark.com/nexperia/74lvc3g17dc-125/buffer-non-inverting-triple-vssop/dp/33AC1281?ost=33ac1281; Manufacturer Part Number 1: 74LVC3G17DC,125
X2 = XTAL OSC 25MHz 3.3V: Oscillator XO 25MHz ±15ppm 15pF CMOS 55% 2.5V/3.3V 4-Pin Mini-CSMD T/R; Frequency: 32.768kHz; Load Capacitance: 12.5pF; Supplier 1: Digi-Key; Supplier Part Number 1: 1253-1254-6-ND; Part Number: XTAL OSC 25MHz 3.3V; Supplier URL 1: https://www.digikey.ca/en/products/detail/kyocera-avx/KC2520C25-0000C2LE00/4867084?s=N4IgTCBcDaIIxgKwGYC0DEBZUDZUDkAREAXQF8g; Manufacturer Part Number 1: KC2520C25.0000C2LE00